# EAGLE design Schematic_tema (EAGLE 9.7.0)

## Sheet 1 of 2
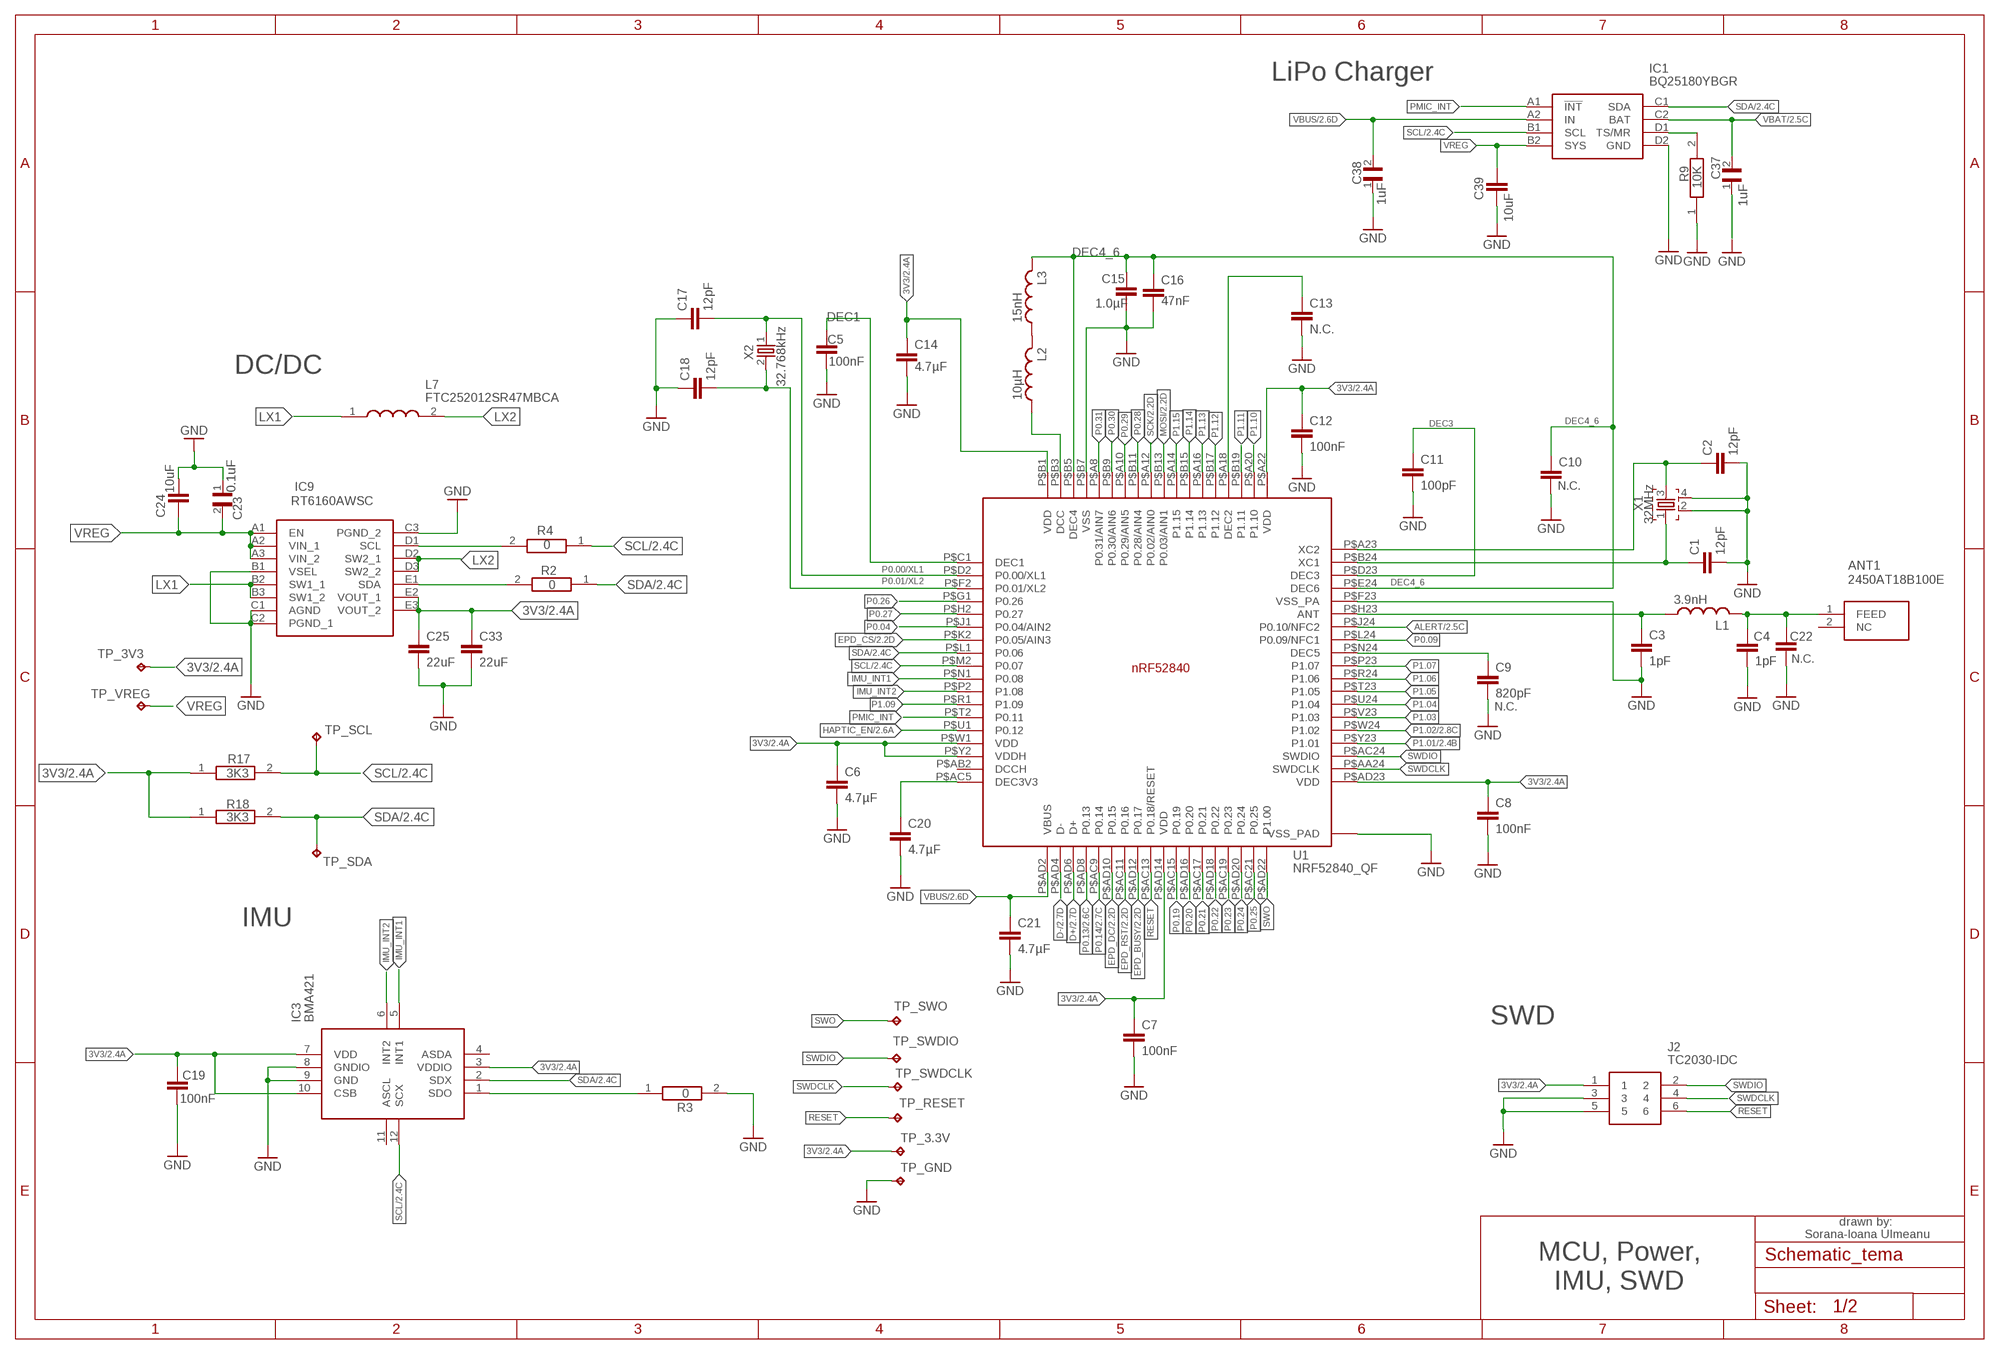
[diagram p0: schematic, sheet 1]

### Parts
ANT1  2450AT18B100E  2450AT18B100E_2450AT18B100E  [2450AT18B100E_ANTC3216X140N]
C1  12pF  PERFECT_0402_CAP_0402  [PERFECT_0402_0402]
C2  12pF  PERFECT_0402_CAP_0402  [PERFECT_0402_0402]
C3  1pF  PERFECT_0402_CAP_0402  [PERFECT_0402_0402]
C4  1pF  PERFECT_0402_CAP_0402  [PERFECT_0402_0402]
C5  100nF  PERFECT_0402_CAP_0402  [PERFECT_0402_0402]
C6  4.7µF  PERFECT_0402_CAP_0402  [PERFECT_0402_0402]
C7  100nF  PERFECT_0402_CAP_0402  [PERFECT_0402_0402]
C8  100nF  PERFECT_0402_CAP_0402  [PERFECT_0402_0402]
C9  820pF  PERFECT_0402_CAP_0402  [PERFECT_0402_0402]
C10  PERFECT_0402_CAP_0402  [PERFECT_0402_0402]
C11  100pF  PERFECT_0402_CAP_0402  [PERFECT_0402_0402]
C12  100nF  PERFECT_0402_CAP_0402  [PERFECT_0402_0402]
C13  N.C.  PERFECT_0402_CAP_0402  [PERFECT_0402_0402]
C14  4.7µF  PERFECT_0402_CAP_0402  [PERFECT_0402_0402]
C15  1.0µF  PERFECT_0402_CAP_0402  [PERFECT_0402_0402]
C16  47nF  PERFECT_0402_CAP_0402  [PERFECT_0402_0402]
C17  12pF  PERFECT_0402_CAP_0402  [PERFECT_0402_0402]
C18  12pF  PERFECT_0402_CAP_0402  [PERFECT_0402_0402]
C19  100nF  PERFECT_0402_CAP_0402  [PERFECT_0402_0402]
C20  4.7µF  PERFECT_0402_CAP_0402  [PERFECT_0402_0402]
C21  4.7µF  PERFECT_0402_CAP_0402  [PERFECT_0402_0402]
C22  PERFECT_0402_CAP_0402  [PERFECT_0402_0402]
C23  0.1uF  GRM011R60J152KE01L_1_GRM011R60J152KE01L  [GRM011R60J152KE01L_1_0201]
C24  10uF  PERFECT_0402_CAP_0402  [PERFECT_0402_0402]
C25  22uF  PERFECT_0402_CAP_0402  [PERFECT_0402_0402]
C33  22uF  PERFECT_0402_CAP_0402  [PERFECT_0402_0402]
C37  1uF  GRM011R60J152KE01L_1_GRM011R60J152KE01L  [GRM011R60J152KE01L_1_0201]
C38  1uF  GRM011R60J152KE01L_1_GRM011R60J152KE01L  [GRM011R60J152KE01L_1_0201]
C39  10uF  PERFECT_0402_CAP_0402  [PERFECT_0402_0402]
IC1  BQ25180YBGR  BQ25180YBGR_BQ25180YBGR  [BQ25180YBGR_BGA8C40P2X4_100X155X50]
IC3  BMA421  BMA423_BMA423  [BMA423_BMA423]
IC9  RT6160AWSC  RT6160AWSC_RT6160AWSC  [RT6160AWSC_BGA15C40P3X5_140X230X60]
J2  TC2030-IDC  TC2030-IDC_TC2030-IDC  [TC2030-IDC_TC2030IDC]
L1  3.9nH  NORDIC_NRF_2_INDUCTOR_0402_L  [NORDIC_NRF_2_RESC0402_L]
L2  10µH  NORDIC_NRF_2_INDUCTOR_0402_L  [NORDIC_NRF_2_RESC0402_L]
L3  15nH  NORDIC_NRF_2_INDUCTOR_0402_L  [NORDIC_NRF_2_RESC0402_L]
L7  FTC252012SR47MBCA  MLP2016SR47MT0S1_FTC252012SR47MBCA  [MLP2016SR47MT0S1_INDC2016X100N]
R2  0  CPF0201D7K68C1_CPF0201D7K68C1  [CPF0201D7K68C1_0201]
R3  0  ERA-1AEB3401C_CPF0201D7K68C1  [ERA-1AEB3401C_0201]
R4  0  CPF0201D7K68C1_CPF0201D7K68C1  [CPF0201D7K68C1_0201]
R9  10K  CPF0201D7K68C1_CPF0201D7K68C1  [CPF0201D7K68C1_0201]
R17  3K3  CPF0201D7K68C1_CPF0201D7K68C1  [CPF0201D7K68C1_0201]
R18  3K3  CPF0201D7K68C1_CPF0201D7K68C1  [CPF0201D7K68C1_0201]
TP_3.3V  HECTOR_WATCH_1_TPTP20R  [HECTOR_WATCH_1_TP20R]
TP_3V3  HECTOR_WATCH_1_TPTP20R  [HECTOR_WATCH_1_TP20R]
TP_GND  HECTOR_WATCH_1_TPTP20R  [HECTOR_WATCH_1_TP20R]
TP_RESET  HECTOR_WATCH_1_TPTP20R  [HECTOR_WATCH_1_TP20R]
TP_SCL  HECTOR_WATCH_1_TPTP20R  [HECTOR_WATCH_1_TP20R]
TP_SDA  HECTOR_WATCH_1_TPTP20R  [HECTOR_WATCH_1_TP20R]
TP_SWDCLK  HECTOR_WATCH_1_TPTP20R  [HECTOR_WATCH_1_TP20R]
TP_SWDIO  HECTOR_WATCH_1_TPTP20R  [HECTOR_WATCH_1_TP20R]
TP_SWO  HECTOR_WATCH_1_TPTP20R  [HECTOR_WATCH_1_TP20R]
TP_VREG  HECTOR_WATCH_1_TPTP20R  [HECTOR_WATCH_1_TP20R]
U1  NRF52840_QF  NORDIC_NRF_4_NRF52840_QF  [NORDIC_NRF_4_AQFN50P700X700X85_HS-74N]
X1  32MHz  NORDIC_NRF_XTAL_32MHZ  [NORDIC_NRF_BT-XTAL_2016_N]
X2  32.768kHz  NORDIC_NRF_1_XTAL_32KHZ  [NORDIC_NRF_1_XTAL_3215_N]

### Nets
3V3/2.4A: C6.1 C7.1 C8.1 C12.1 C14.1 C19.1 C25.1 C33.1 IC3.3(VDDIO) IC3.7(VDD) IC3.10(CSB) IC9.E2(VOUT_1) IC9.E3(VOUT_2) J2.1 R17.1 R18.1 TP_3.3V.TP TP_3V3.TP U1.P$A22(VDD) U1.P$AD14(VDD) U1.P$AD23(VDD) U1.P$B1(VDD) U1.P$W1(VDD) U1.P$Y2(VDDH)
ALERT/2.5C: U1.P$J24(P0.10/NFC2)
D+/2.7D: U1.P$AD6(D+)
D-/2.7D: U1.P$AD4(D-)
EPD_BUSY/2.2D: U1.P$AD12(P0.17)
EPD_CS/2.2D: U1.P$K2(P0.05/AIN3)
EPD_DC/2.2D: U1.P$AD10(P0.15)
EPD_RST/2.2D: U1.P$AC11(P0.16)
GND: C1.2 C2.2 C3.2 C4.2 C5.1 C6.2 C7.2 C8.2 C9.2 C10.2 C11.2 C12.2 C13.2 C14.2 C15.2 C16.2 C17.1 C18.1 C19.2 C20.2 C21.2 C22.2 C23.1 C24.1 C25.2 C33.2 C38.1 C39.2 IC1.D2(GND) IC3.8(GNDIO) IC3.9(GND) IC9.B1(VSEL) IC9.C1(AGND) IC9.C2(PGND_1) IC9.C3(PGND_2) J2.3 J2.5 R3.2 R9.1 TP_GND.TP U1.P$74(VSS_PAD) U1.P$75(VSS_PAD) U1.P$76(VSS_PAD) U1.P$77(VSS_PAD) U1.P$78(VSS_PAD) U1.P$79(VSS_PAD) U1.P$80(VSS_PAD) U1.P$81(VSS_PAD) U1.P$82(VSS_PAD) U1.P$83(VSS_PAD) U1.P$84(VSS_PAD) U1.P$85(VSS_PAD) U1.P$86(VSS_PAD) U1.P$87(VSS_PAD) U1.P$88(VSS_PAD) U1.P$89(VSS_PAD) U1.P$90(VSS_PAD) U1.P$B7(VSS) U1.P$F23(VSS_PA) X1.2 X1.4 ; also sheet 2
HAPTIC_EN/2.6A: U1.P$U1(P0.12)
IMU_INT1: IC3.5(INT1) U1.P$N1(P0.08)
IMU_INT2: IC3.6(INT2) U1.P$P2(P1.08)
LX1: IC9.B2(SW1_1) IC9.B3(SW1_2) L7.1
LX2: IC9.D2(SW2_1) IC9.D3(SW2_2) L7.2
MOSI/2.2D: U1.P$B13(P0.03/AIN1)
N$1: IC3.1(SDO) R3.1
N$2: C5.2 U1.P$C1(DEC1)
N$3: L2.2 U1.P$B3(DCC)
N$4: C37.1
N$5: IC9.D1(SCL) R4.2
N$6: C10.1 C15.1 C16.1 L3.1 U1.P$B5(DEC4) U1.P$E24(DEC6)
N$7: IC1.D1(TS/MR) R9.2
N$8: IC9.E1(SDA) R2.2
N$9: C13.1 U1.P$A18(DEC2)
N$10: L2.1 L3.2
N$12: C17.2 U1.P$D2(P0.00/XL1) X2.1
N$13: C18.2 U1.P$F2(P0.01/XL2) X2.2
N$14: C20.1 U1.P$AC5(DEC3V3)
N$15: C11.1 U1.P$D23(DEC3)
N$16: C2.1 U1.P$A23(XC2) X1.3
N$17: C1.1 U1.P$B24(XC1) X1.1
N$18: C3.1 L1.1 U1.P$H23(ANT)
N$19: ANT1.1(FEED) C4.1 C22.1 L1.2
N$22: C9.1 U1.P$N24(DEC5)
P0.04: U1.P$J1(P0.04/AIN2)
P0.09: U1.P$L24(P0.09/NFC1)
P0.13/2.6C: U1.P$AD8(P0.13)
P0.14/2.7C: U1.P$AC9(P0.14)
P0.19: U1.P$AC15(P0.19)
P0.20: U1.P$AD16(P0.20)
P0.21: U1.P$AC17(P0.21)
P0.22: U1.P$AD18(P0.22)
P0.23: U1.P$AC19(P0.23)
P0.24: U1.P$AD20(P0.24)
P0.25: U1.P$AC21(P0.25)
P0.26: U1.P$G1(P0.26)
P0.27: U1.P$H2(P0.27)
P0.28: U1.P$B11(P0.28/AIN4)
P0.29: U1.P$A10(P0.29/AIN5)
P0.30: U1.P$B9(P0.30/AIN6)
P0.31: U1.P$A8(P0.31/AIN7)
P1.01/2.4B: U1.P$Y23(P1.01)
P1.02/2.8C: U1.P$W24(P1.02)
P1.03: U1.P$V23(P1.03)
P1.04: U1.P$U24(P1.04)
P1.05: U1.P$T23(P1.05)
P1.06: U1.P$R24(P1.06)
P1.07: U1.P$P23(P1.07)
P1.09: U1.P$R1(P1.09)
P1.10: U1.P$A20(P1.10)
P1.11: U1.P$B19(P1.11)
P1.12: U1.P$B17(P1.12)
P1.13: U1.P$A16(P1.13)
P1.14: U1.P$B15(P1.14)
P1.15: U1.P$A14(P1.15)
PMIC_INT: IC1.A1(!INT) U1.P$T2(P0.11)
RESET: J2.6 TP_RESET.TP U1.P$AC13(P0.18/RESET)
SCK/2.2D: U1.P$A12(P0.02/AIN0)
SCL/2.4C: IC1.B1(SCL) IC3.12(SCX) R4.1 R17.2 TP_SCL.TP U1.P$M2(P0.07)
SDA/2.4C: IC1.C1(SDA) IC3.2(SDX) R2.1 R18.2 TP_SDA.TP U1.P$L1(P0.06)
SWDCLK: J2.4 TP_SWDCLK.TP U1.P$AA24(SWDCLK)
SWDIO: J2.2 TP_SWDIO.TP U1.P$AC24(SWDIO)
SWO: TP_SWO.TP U1.P$AD22(P1.00)
VBAT/2.5C: C37.2 IC1.C2(BAT)
VBUS/2.6D: C21.1 C38.2 IC1.A2(IN) U1.P$AD2(VBUS)
VREG: C23.2 C24.2 C39.1 IC1.B2(SYS) IC9.A1(EN) IC9.A2(VIN_1) IC9.A3(VIN_2) TP_VREG.TP
Unconnected: ANT1.2(NC) IC3.4(ASDA) IC3.11(ASCL) U1.P$AB2(DCCH)

### Notes on the sheet
- LiPo Charger
- DEC4_6
- DEC1
- DC/DC
- DEC4_6
- DEC3
- N.C.
- P0.00/XL1
- P0.01/XL2 | DEC4_6
- N.C.
- N.C.
- IMU
- SWD
- drawn by: 
  Sorana-Ioana Ulmeanu
- MCU, Power,
  IMU, SWD

## Sheet 2 of 2
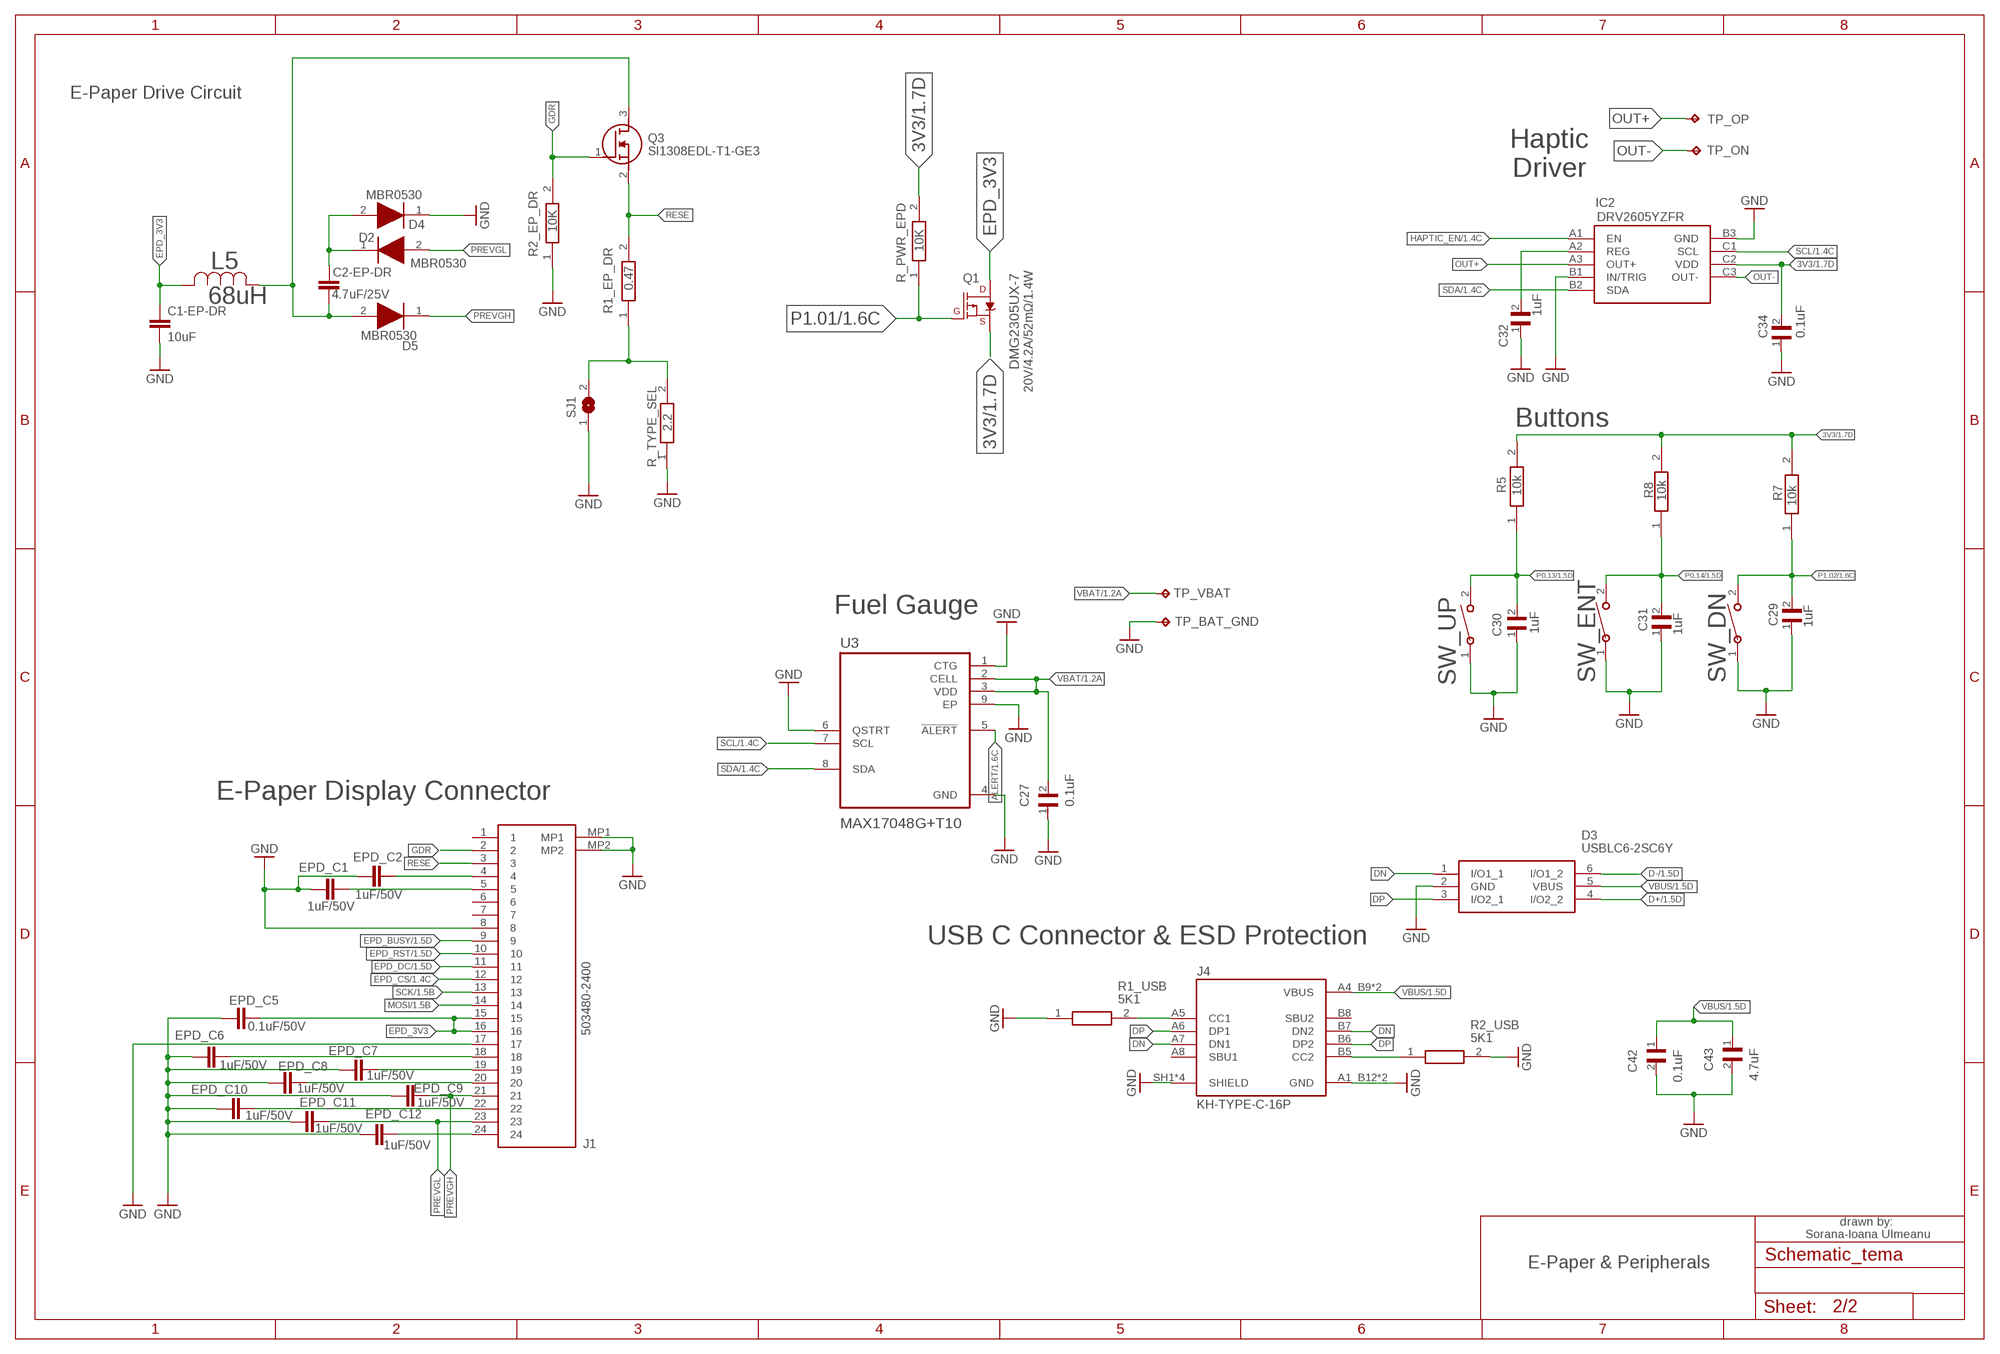
[diagram p1: schematic, sheet 2]

### Parts
C1-EP-DR  10uF  PERFECT_0402_CAP_0402  [PERFECT_0402_0402]
C2-EP-DR  4.7uF/25V  PERFECT_0402_CAP_0402  [PERFECT_0402_0402]
C27  0.1uF  GRM011R60J152KE01L_1_GRM011R60J152KE01L  [GRM011R60J152KE01L_1_0201]
C29  1uF  GRM011R60J152KE01L_1_GRM011R60J152KE01L  [GRM011R60J152KE01L_1_0201]
C30  1uF  GRM011R60J152KE01L_1_GRM011R60J152KE01L  [GRM011R60J152KE01L_1_0201]
C31  1uF  GRM011R60J152KE01L_1_GRM011R60J152KE01L  [GRM011R60J152KE01L_1_0201]
C32  1uF  GRM011R60J152KE01L_2_GRM011R60J152KE01L  [GRM011R60J152KE01L_2_CAPC0201X13N]
C34  0.1uF  GRM011R60J152KE01L_2_GRM011R60J152KE01L  [GRM011R60J152KE01L_2_CAPC0201X13N]
C42  0.1uF  GRM011R60J152KE01L_1_GRM011R60J152KE01L  [GRM011R60J152KE01L_1_0201]
C43  4.7uF  GRM011R60J152KE01L_1_GRM011R60J152KE01L  [GRM011R60J152KE01L_1_0201]
D2  MBR0530  ESP32_C6_LIBRARY_5_MBR0530  [ESP32_C6_LIBRARY_5_SOD3716X135N]
D3  USBLC6-2SC6Y  ESP32_C6_LIBRARY_3_USBLC6-2SC6Y  [ESP32_C6_LIBRARY_3_SOT95P280X145-6N]
D4  MBR0530  ESP32_C6_LIBRARY_5_MBR0530  [ESP32_C6_LIBRARY_5_SOD3716X135N]
D5  MBR0530  ESP32_C6_LIBRARY_5_MBR0530  [ESP32_C6_LIBRARY_5_SOD3716X135N]
EPD_C1  1uF/50V  PERFECT_0402_CAP_0402  [PERFECT_0402_0402]
EPD_C2  1uF/50V  PERFECT_0402_CAP_0402  [PERFECT_0402_0402]
EPD_C5  0.1uF/50V  PERFECT_0402_CAP_0402  [PERFECT_0402_0402]
EPD_C6  1uF/50V  PERFECT_0402_CAP_0402  [PERFECT_0402_0402]
EPD_C7  1uF/50V  PERFECT_0402_CAP_0402  [PERFECT_0402_0402]
EPD_C8  1uF/50V  PERFECT_0402_CAP_0402  [PERFECT_0402_0402]
EPD_C9  1uF/50V  PERFECT_0402_CAP_0402  [PERFECT_0402_0402]
EPD_C10  1uF/50V  PERFECT_0402_CAP_0402  [PERFECT_0402_0402]
EPD_C11  1uF/50V  PERFECT_0402_CAP_0402  [PERFECT_0402_0402]
EPD_C12  1uF/50V  PERFECT_0402_CAP_0402  [PERFECT_0402_0402]
IC2  DRV2605YZFR  DRV2605YZFR_DRV2605YZFR  [DRV2605YZFR_BGA9C50P3X3_144X144X62]
J1  503480-2400  503480-2400_503480-2400  [503480-2400_5034802400]
J4  KH-TYPE-C-16P  KH-TYPE-C-16P_KH-TYPE-C-16P  [KH-TYPE-C-16P_KINGHELM_KH-TYPE-C-16P]
L5  68uH  ESP32_C6_LIBRARY_2_744043680IND_4828-WE-TPC_WRE  [ESP32_C6_LIBRARY_2_IND_4828-WE-TPC_WRE]
Q1  20V/4.2A/52mΩ/1.4W  ESP32_C6_LIBRARY_4_ESP32_WROVER_SPARKFUN-DISCRETESEMI_MOSFET_PCH-DMG2305UX-7  [ESP32_C6_LIBRARY_4_ESP32_C6_LIBRARY_4_ESP32_C6_LIBRARY_4_ESP32_C6_LIBRARY_4_ESP32_WROVER_SPARKFUN-DISCRETESEMI_SOT23-3]
Q3  SI1308EDL-T1-GE3  ESP32_C6_LIBRARY_6_SI1308EDL-T1-GE3  [ESP32_C6_LIBRARY_6_SOT65P210X110-3N]
R1_EP_DR  0.47  CPF0201D7K68C1_CPF0201D7K68C1  [CPF0201D7K68C1_0201]
R1_USB  5K1  CPF0201D7K68C1_CPF0201D7K68C1  [CPF0201D7K68C1_0201]
R2_EP_DR  10K  ERA-1AEB3401C_CPF0201D7K68C1  [ERA-1AEB3401C_0201]
R2_USB  5K1  CPF0201D7K68C1_CPF0201D7K68C1  [CPF0201D7K68C1_0201]
R5  10k  CPF0201D7K68C1_CPF0201D7K68C1  [CPF0201D7K68C1_0201]
R7  10k  CPF0201D7K68C1_CPF0201D7K68C1  [CPF0201D7K68C1_0201]
R8  10k  CPF0201D7K68C1_CPF0201D7K68C1  [CPF0201D7K68C1_0201]
R_PWR_EPD  10K  CPF0201D7K68C1_CPF0201D7K68C1  [CPF0201D7K68C1_0201]
R_TYPE_SEL  2.2  ERA-1AEB3401C_CPF0201D7K68C1  [ERA-1AEB3401C_0201]
SJ1  ESP32_C6_LIBRARY_7_JUMPER_SJ  [ESP32_C6_LIBRARY_7_JUMPER_SJ]
SW_DN  2025-10-22_07-23-44_LIBRARY_EVP-AKE31ASW_EVP-AKE31A_PAN  [2025-10-22_07-23-44_LIBRARY_SW_EVP-AKE31A_PAN]
SW_ENT  2025-10-22_07-23-44_LIBRARY_EVP-AKE31ASW_EVP-AKE31A_PAN  [2025-10-22_07-23-44_LIBRARY_SW_EVP-AKE31A_PAN]
SW_UP  2025-10-22_07-23-44_LIBRARY_EVP-AKE31ASW_EVP-AKE31A_PAN  [2025-10-22_07-23-44_LIBRARY_SW_EVP-AKE31A_PAN]
TP_BAT_GND  HECTOR_WATCH_1_TPTP20R  [HECTOR_WATCH_1_TP20R]
TP_ON  HECTOR_WATCH_1_TPTP20R  [HECTOR_WATCH_1_TP20R]
TP_OP  HECTOR_WATCH_1_TPTP20R  [HECTOR_WATCH_1_TP20R]
TP_VBAT  HECTOR_WATCH_1_TPTP20R  [HECTOR_WATCH_1_TP20R]
U3  MAX17048G+T10  ESP32_C6_LIBRARY_MAX17048G+T10  [ESP32_C6_LIBRARY_SON50P200X200X80-9N]

### Nets
3V3/1.7D: C34.2 IC2.C2(VDD) Q1.2(S) R5.2 R7.2 R8.2 R_PWR_EPD.2
ALERT/1.6C: U3.5(!ALERT)
D+/1.5D: D3.4(I/O2_2)
D-/1.5D: D3.6(I/O1_2)
DN: D3.1(I/O1_1) J4.A7(DN1) J4.B7(DN2)
DP: D3.3(I/O2_1) J4.A6(DP1) J4.B6(DP2)
EPD_3V3: C1-EP-DR.1 EPD_C5.2 J1.15 J1.16 L5.2 Q1.3(D)
EPD_BUSY/1.5D: J1.9
EPD_CS/1.4C: J1.12
EPD_DC/1.5D: J1.11
EPD_RST/1.5D: J1.10
GDR: J1.2 Q3.1(G) R2_EP_DR.2
GND: C1-EP-DR.2 C27.1 C29.1 C30.1 C31.1 C32.1 C34.1 C42.2 C43.2 D3.2(GND) D4.1(K) EPD_C1.1 EPD_C2.1 EPD_C5.1 EPD_C6.1 EPD_C7.1 EPD_C8.1 EPD_C9.1 EPD_C10.1 EPD_C11.1 EPD_C12.1 IC2.B1(IN/TRIG) IC2.B3(GND) J1.8 J1.17 J1.MP1 J1.MP2 J4.A1_B12(GND) J4.A12_B1(GND) J4.SH1(SHIELD) J4.SH2(SHIELD) J4.SH3(SHIELD) J4.SH4(SHIELD) R1_USB.1 R2_EP_DR.1 R2_USB.2 R_TYPE_SEL.1 SJ1.1 SW_DN.1 SW_ENT.1 SW_UP.1 TP_BAT_GND.TP U3.1(CTG) U3.4(GND) U3.6(QSTRT) U3.9(EP) ; also sheet 1
HAPTIC_EN/1.4C: IC2.A1(EN)
MOSI/1.5B: J1.14
N$11: C2-EP-DR.2 D5.2(A) L5.1 Q3.3(D)
N$21: R1_EP_DR.1 R_TYPE_SEL.2 SJ1.2
N$23: C2-EP-DR.1 D2.1(K) D4.2(A)
N$24: EPD_C2.2 J1.4
N$25: C32.2 IC2.A2(REG)
N$26: EPD_C1.2 J1.5
N$27: J4.A5(CC1) R1_USB.2
N$29: EPD_C6.2 J1.18
N$30: EPD_C7.2 J1.19
N$31: EPD_C8.2 J1.20
N$32: J4.B5(CC2) R2_USB.1
N$33: EPD_C10.2 J1.22
N$35: EPD_C12.2 J1.24
OUT+: IC2.A3(OUT+) TP_OP.TP
OUT-: IC2.C3(OUT-) TP_ON.TP
P0.13/1.5D: C30.2 R5.1 SW_UP.2
P0.14/1.5D: C31.2 R8.1 SW_ENT.2
P1.01/1.6C: Q1.1(G) R_PWR_EPD.1
P1.02/1.6C: C29.2 R7.1 SW_DN.2
PREVGH: D5.1(K) EPD_C9.2 J1.21
PREVGL: D2.2(A) EPD_C11.2 J1.23
RESE: J1.3 Q3.2(S) R1_EP_DR.2
SCK/1.5B: J1.13
SCL/1.4C: IC2.C1(SCL) U3.7(SCL)
SDA/1.4C: IC2.B2(SDA) U3.8(SDA)
VBAT/1.2A: C27.2 TP_VBAT.TP U3.2(CELL) U3.3(VDD)
VBUS/1.5D: C42.1 C43.1 D3.5(VBUS) J4.A4_B9(VBUS) J4.A9_B4(VBUS)
Unconnected: J1.1 J1.6 J1.7 J4.A8(SBU1) J4.B8(SBU2)

### Notes on the sheet
- E-Paper Drive Circuit
- Haptic
  Driver
- DMG2305UX-7
- Buttons
- Fuel Gauge
- E-Paper Display Connector
- USB C Connector & ESD Protection
- drawn by: 
  Sorana-Ioana Ulmeanu
- E-Paper & Peripherals

## Library data of the parts
ANT1 = InkTime_v5:2450AT18B100E_2450AT18B100E: Antennas 2.45GHz ANTENNA Source: Datasheet <https://www.johansontechnology.com/datasheets/2450AT18B100/2450AT18B100.pdf>; ARROW_PART_NUMBER: 2450AT18B100E; ARROW_PRICE-STOCK: https://www.arrow.com/en/products/2450at18b100e/johanson-dielectrics?utm_currency=USD&region=nac; DESCRIPTION: Antennas 2.45GHz ANTENNA; HEIGHT: 1.4mm; MANUFACTURER_NAME: JOHANSON TECHNOLOGY; MANUFACTURER_PART_NUMBER: 2450AT18B100E; MOUSER_PART_NUMBER: 609-2450AT18B100E; MOUSER_PRICE-STOCK: https://www.mouser.co.uk/ProductDetail/Johanson-Technology/2450AT18B100E?qs=yCnrNFeXz%252Bh5MFsFIXGZGA%3D%3D
C1 C1-EP-DR C2 C2-EP-DR C3-C22 C24 C25 C33 C39 EPD_C1 EPD_C2 EPD_C5-EPD_C12 = InkTime_v5:PERFECT_0402_CAP_0402: 0402 (1005 Metric) Nick Garner - TeleSense
C23 C27 C29-C31 C37 C38 C42 C43 = InkTime_v5:GRM011R60J152KE01L_1_GRM011R60J152KE01L: Check availability <https://pricing.snapeda.com/parts/GRM011R60J152KE01L/Murata/view-part?ref=eda>
C32 C34 = InkTime_v5:GRM011R60J152KE01L_2_GRM011R60J152KE01L: Check availability <https://pricing.snapeda.com/parts/GRM011R60J152KE01L/Murata/view-part?ref=eda>; AVAILABILITY: In Stock; CHECK_PRICES: https://www.snapeda.com/parts/GRM011R60J152KE01L/Murata/view-part/?ref=eda; DESCRIPTION: SMD Capacitor X5R(EIA) with Capacitance: 1500pF Tol. 10%. Rated Voltage: 6.3Vdc; MF: Murata; MP: GRM011R60J152KE01L; PACKAGE: 0201 Murata; PRICE: None; SNAPEDA_LINK: https://www.snapeda.com/parts/GRM011R60J152KE01L/Murata/view-part/?ref=snap
D2 D4 D5 = InkTime_v5:ESP32_C6_LIBRARY_5_MBR0530: ON SEMICONDUCTOR - MBR0530 - DIODE, SCHOTTKY, 0.5A, 30V, SOD-123 Source: Datasheet <http://www.onsemi.com/pub/Collateral/MBR0530T1-D.PDF> Check availability <https://pricing.snapeda.com/parts/MBR0530/ON%20Semiconductor/view-part?ref=eda>; AVAILABILITY: In Stock; CHECK_PRICES: https://www.snapeda.com/parts/MBR0530/Onsemi/view-part/?ref=eda; DESCRIPTION: Diode Schottky 30 V 500mA Surface Mount SOD-123; MF: ON Semiconductor; MP: MBR0530; PACKAGE: SOD-123-2 ON Semiconductor; PRICE: None; PURCHASE-URL: https://www.snapeda.com/api/url_track_click_mouser/?unipart_id=179458&manufacturer=ON Semiconductor&part_name=MBR0530&search_term=None; SNAPEDA_LINK: https://www.snapeda.com/parts/MBR0530/Onsemi/view-part/?ref=snap
D3 = InkTime_v5:ESP32_C6_LIBRARY_3_USBLC6-2SC6Y: Low Cap. ESD Protection Auto SOT-23-6 STMicroelectronics USBLC6-2SC6Y, Dual Uni-Directional TVS Diode Array, 6-Pin SOT-23 Source: Datasheet <https://componentsearchengine.com/Datasheets/1/USBLC6-2SC6Y.pdf> Check availability <https://pricing.snapeda.com/parts/USBLC6-2SC6Y/STMicroelectronics/view-part?ref=eda>; AVAILABILITY: In Stock; CHECK_PRICES: https://www.snapeda.com/parts/USBLC6-2SC6Y/STMicroelectronics/view-part/?ref=eda; DESCRIPTION: 17V Clamp 5A (8/20µs) Ipp Tvs Diode Surface Mount SOT-23-6; MF: STMicroelectronics; MP: USBLC6-2SC6Y; PACKAGE: SOT-23-6 STMicroelectronics; PRICE: None; SNAPEDA_LINK: https://www.snapeda.com/parts/USBLC6-2SC6Y/STMicroelectronics/view-part/?ref=snap
IC1 = InkTime_v5:BQ25180YBGR_BQ25180YBGR: Charger IC Lithium Ion/Polymer, Lithium Iron Phosphate 8-DSBGA (1.6x1.1) Source: Datasheet <https://www.ti.com/lit/ds/symlink/bq25180.pdf?ts=1650264094470&ref_url=https%3A%2F%2Fwww.ti.com%2Fproduct%2FBQ25180>; ARROW_PART_NUMBER: BQ25180YBGR; ARROW_PRICE-STOCK: https://www.arrow.com/en/products/bq25180ybgr/texas-instruments?utm_currency=USD&region=nac; DESCRIPTION: Charger IC Lithium Ion/Polymer, Lithium Iron Phosphate 8-DSBGA (1.6x1.1); HEIGHT: 0.5mm; MANUFACTURER_NAME: Texas Instruments; MANUFACTURER_PART_NUMBER: BQ25180YBGR; MOUSER_PART_NUMBER: 595-BQ25180YBGR; MOUSER_PRICE-STOCK: https://www.mouser.co.uk/ProductDetail/Texas-Instruments/BQ25180YBGR?qs=doiCPypUmgEWjAK%252BJAX6Tw%3D%3D
IC2 = InkTime_v5:DRV2605YZFR_DRV2605YZFR: Haptic Driver for ERM/LRA with Built-In Library and Smart Loop Architecture Source: Datasheet <http://www.ti.com/lit/gpn/drv2605>; ARROW_PART_NUMBER: DRV2605YZFR; ARROW_PRICE-STOCK: https://www.arrow.com/en/products/drv2605yzfr/texas-instruments?region=nac; DESCRIPTION: Haptic Driver for ERM/LRA with Built-In Library and Smart Loop Architecture; HEIGHT: 0.625mm; MANUFACTURER_NAME: Texas Instruments; MANUFACTURER_PART_NUMBER: DRV2605YZFR
IC3 = InkTime_v5:BMA423_BMA423: Accelerometers Triaxial low-g 12bit Acceleration Sensor Source: Datasheet <https://www.mouser.com/datasheet/2/783/BST-BMA423-DS000-1509600.pdf>; ARROW_PART_NUMBER: BMA423; ARROW_PRICE-STOCK: https://www.arrow.com/en/products/bma423/bosch; DESCRIPTION: Accelerometers Triaxial low-g 12bit Acceleration Sensor; HEIGHT: 1mm; MANUFACTURER_NAME: BOSCH; MANUFACTURER_PART_NUMBER: BMA423; MOUSER_PART_NUMBER: 262-BMA423; MOUSER_PRICE-STOCK: https://www.mouser.co.uk/ProductDetail/Bosch-Sensortec/BMA423?qs=HXFqYaX1Q2xC%252BSgeGoX3mg%3D%3D; SPICEPREFIX: X
IC9 = InkTime_v5:RT6160AWSC_RT6160AWSC: Buck-Boost Regulator Positive Output Step-Up/Step-Down I2C DC-DC Controller IC 15-WL-CSP (BSC) (1.4x2.3) Source: Datasheet <https://www.richtek.com/SaveDownload.aspx?specid=RT6160A>; DESCRIPTION: Buck-Boost Regulator Positive Output Step-Up/Step-Down I2C DC-DC Controller IC 15-WL-CSP (BSC) (1.4x2.3); HEIGHT: 0.6mm; MANUFACTURER_NAME: RICHTEK; MANUFACTURER_PART_NUMBER: RT6160AWSC; MOUSER_PART_NUMBER: 835-RT6160AWSC; MOUSER_PRICE-STOCK: https://www.mouser.co.uk/ProductDetail/Richtek/RT6160AWSC?qs=amGC7iS6iy%2FLd9PSoixZXQ%3D%3D
J1 = InkTime_v5:503480-2400_503480-2400: FFC & FPC Connectors 0.5mm FPC RA SMT Dual Contact 24Ckt Source: Datasheet <https://componentsearchengine.com/Datasheets/1/503480-2400.pdf>; DESCRIPTION: FFC & FPC Connectors 0.5mm FPC RA SMT Dual Contact 24Ckt; HEIGHT: 1.87mm; MANUFACTURER_NAME: Molex; MANUFACTURER_PART_NUMBER: 503480-2400; MOUSER_PART_NUMBER: 538-503480-2400; MOUSER_PRICE-STOCK: https://www.mouser.co.uk/ProductDetail/Molex/503480-2400?qs=OAhjpuo3Vu7efIoxFh9AOw%3D%3D
J2 = InkTime_v5:TC2030-IDC_TC2030-IDC: CABLE ADAPTER 6 POS Source: Datasheet <https://datasheet.datasheetarchive.com/originals/distributors/Datasheets_SAMA/62bc384e093448baaaa63dbd0b9d8707.pdf>; DESCRIPTION: CABLE ADAPTER 6 POS; HEIGHT: 19mm; MANUFACTURER_NAME: Tag Connect; MANUFACTURER_PART_NUMBER: TC2030-IDC
J4 = InkTime_v5:KH-TYPE-C-16P_KH-TYPE-C-16P: Check availability <https://pricing.snapeda.com/parts/KH-TYPE-C-16P/kinghelm/view-part?ref=eda>; AVAILABILITY: Not in stock; CHECK_PRICES: https://www.snapeda.com/parts/KH-TYPE-C-16P/Kinghelm/view-part/?ref=eda; MF: kinghelm; MP: KH-TYPE-C-16P; PACKAGE: None; PRICE: None; SNAPEDA_LINK: https://www.snapeda.com/parts/KH-TYPE-C-16P/Kinghelm/view-part/?ref=snap
L1-L3 = InkTime_v5:NORDIC_NRF_2_INDUCTOR: Generic chip inductor
L5 = InkTime_v5:ESP32_C6_LIBRARY_2_744043680; COPYRIGHT: Copyright (C) 2024 Ultra Librarian. All rights reserved.; MANUFACTURER_PART_NUMBER: 744043680; MFR_NAME: Wurth Electronics
L7 = InkTime_v5:MLP2016SR47MT0S1_FTC252012SR47MBCA: SMD / SMT Inductors (Coils), L=0.47?H, L x W x T : Source: Datasheet <https://product.tdk.com/system/files/dam/doc/product/inductor/inductor/smd/catalog/inductor_commercial_power_mlp2016_en.pdf>; DESCRIPTION: SMD / SMT Inductors (Coils), L=0.47?H, L x W x T :; HEIGHT: 1mm; JLCPCB: https://jlcpcb.com/partdetail/6763488-FTC252012SR47MBCA/C5832368; MANUFACTURER_NAME: TDK; MANUFACTURER_PART_NUMBER: FTC252012SR47MBCA
Q1 = InkTime_v5:ESP32_C6_LIBRARY_4_ESP32_WROVER_SPARKFUN-DISCRETESEMI_MOSFET_PCH: P-channel MOSFETs Voltage controlled devices that allow control of high current outputs. SparkFun Products: SparkFun ESP32 Thing <https://www.sparkfun.com/products/13907> SparkFun ESP8266 Thing <https://www.sparkfun.com/products/13231> SparkFun Pi Servo HAT V2 <https://www.sparkfun.com/products/15316> DMG2305UX-7 (20V/4.2A/SOT23-3); PROD_ID: TRAN-14388
Q3 = InkTime_v5:ESP32_C6_LIBRARY_6_SI1308EDL-T1-GE3: MOSFET N-Ch 30V 1.5A TrenchFET SC70 Vishay Si1308EDL-T1-GE3 N-channel MOSFET Transistor, 1.5 A, 30 V, 3-Pin SC-70 Source: Datasheet <https://componentsearchengine.com/Datasheets/1/SI1308EDL-T1-GE3.pdf> Check availability <https://pricing.snapeda.com/parts/SI1308EDL-T1-GE3/Vishay%20Siliconix/view-part?ref=eda>; AVAILABILITY: In Stock; CHECK_PRICES: https://www.snapeda.com/parts/SI1308EDL-T1-GE3/Vishay+Siliconix/view-part/?ref=eda; DESCRIPTION: Si1308EDL-T1-GE3 N-channel MOSFET Transistor, 1.5 A, 30 V, 3-Pin SC-70 | Siliconix / Vishay SI1308EDL-T1-GE3; MF: Vishay Siliconix; MP: SI1308EDL-T1-GE3; PACKAGE: SOT-323 Vishay Semiconductor; PRICE: None; PURCHASE-URL: https://www.snapeda.com/api/url_track_click_mouser/?unipart_id=274603&manufacturer=Vishay Siliconix&part_name=SI1308EDL-T1-GE3&search_term=None; SNAPEDA_LINK: https://www.snapeda.com/parts/SI1308EDL-T1-GE3/Vishay+Siliconix/view-part/?ref=snap
R1_EP_DR R1_USB R2 R2_USB R4 R5 R7-R9 R17 R18 R_PWR_EPD = InkTime_v5:CPF0201D7K68C1_CPF0201D7K68C1: 7.68k 0201 Thin Film Surface Mount Fixed Resistor +/-0.5% 0.031W CPF0201D7K68C1 Source: Datasheet <http://www.te.com/commerce/DocumentDelivery/DDEController?Action=showdoc&DocId=Data Sheet1773200-1ApdfEnglishENG_DS_1773200-1_A.pdf4-2176215-6>
R2_EP_DR R3 R_TYPE_SEL = InkTime_v5:ERA-1AEB3401C_CPF0201D7K68C1: 7.68k 0201 Thin Film Surface Mount Fixed Resistor +/-0.5% 0.031W CPF0201D7K68C1 Source: Datasheet <http://www.te.com/commerce/DocumentDelivery/DDEController?Action=showdoc&DocId=Data Sheet1773200-1ApdfEnglishENG_DS_1773200-1_A.pdf4-2176215-6>
SJ1 = InkTime_v5:ESP32_C6_LIBRARY_7_JUMPER_SJ: SMD solder JUMPER
SW_DN SW_ENT SW_UP = InkTime_v5:2025-10-22_07-23-44_LIBRARY_EVP-AKE31A; COPYRIGHT: Copyright (C) 2025 Ultra Librarian. All rights reserved.; DIGI-KEY_PART_NUMBER_1: P123437TR-ND; DIGI-KEY_PART_NUMBER_2: P123437CT-ND; DIGI-KEY_PART_NUMBER_3: P123437DKR-ND; MANUFACTURER_NAME: Panasonic; MANUFACTURER_PART_NUMBER: EVP-AKE31A
TP_3.3V TP_3V3 TP_BAT_GND TP_GND TP_ON TP_OP TP_RESET TP_SCL TP_SDA TP_SWDCLK TP_SWDIO TP_SWO TP_VBAT TP_VREG = InkTime_v5:HECTOR_WATCH_1_TP: Test pad
U1 = InkTime_v5:NORDIC_NRF_4_NRF52840_QF: nRF52840 Features Advanced Single chip 2.4 GHz multi-protocol SoC 32-bit ARM Cortex-M4F Processor 1.7v to 5.5v operation 1MB flash + 256kB RAM Bluetooth 5 support for long range and high throughput 802.15.4 radio support On-chip NFC PPI –Programmable Peripheral Interconnect Automated power management system with automatic power management of each peripheral Configurable I/O mapping for analog and digital I/O 48 x GPIO 1 x QSPI 4 x Master/Slave SPI 2 x Two-wire interface (I²C) I²S interface 2 x UART 4 x PWM USB 2.0 controller ARM TrustZone CryptoCell-310 Cryptographic and security module AES 128-bit ECB/CCM/AAR hardware accelerator Digital microphone interface (PDM) Quadrature decoder 12-bit ADC Low power comparator On-chip 50Ω balun On-air compatible with nRF52, nRF51 and nRF24 Series Applications Advanced high performance wearables Wearables for secure payments Virtual Reality/Augmented Reality systems Smart Home sensor networks Smart city sensor networks High performance HID controllers Internet of Things (IoT) sensor networks Smart door locks Smart lighting networks Connected white goods
U3 = InkTime_v5:ESP32_C6_LIBRARY_MAX17048G+T10: Check availability <https://pricing.snapeda.com/parts/MAX17048G%2BT10/Analog%20Devices/view-part?ref=eda>; AVAILABILITY: In Stock; CHECK_PRICES: https://www.snapeda.com/parts/MAX17048G+T10/Analog+Devices/view-part/?ref=eda; DESCRIPTION: 3µA 1-Cell/2-Cell Fuel Gauge with ModelGauge; MF: Analog Devices; MP: MAX17048G+T10; PACKAGE: TDFN-8 Maxim; PRICE: None; PURCHASE-URL: https://www.snapeda.com/api/url_track_click_mouser/?unipart_id=329239&manufacturer=Analog Devices&part_name=MAX17048G+T10&search_term=None; SNAPEDA_LINK: https://www.snapeda.com/parts/MAX17048G+T10/Analog+Devices/view-part/?ref=snap
X1 = InkTime_v5:NORDIC_NRF_XTAL_32MHZ
X2 = InkTime_v5:NORDIC_NRF_1_XTAL_32KHZ

## Board
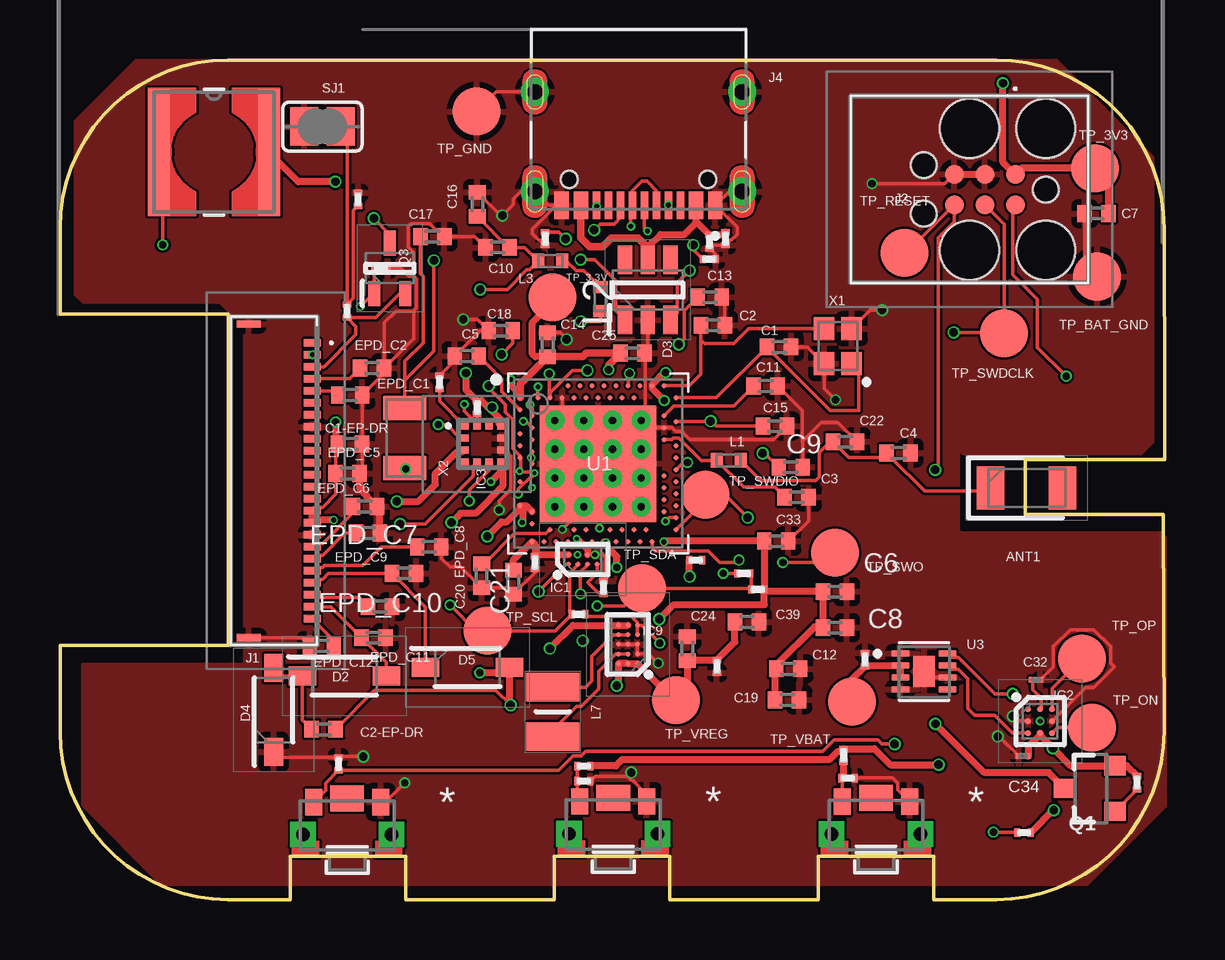
[diagram p2: board, top side]
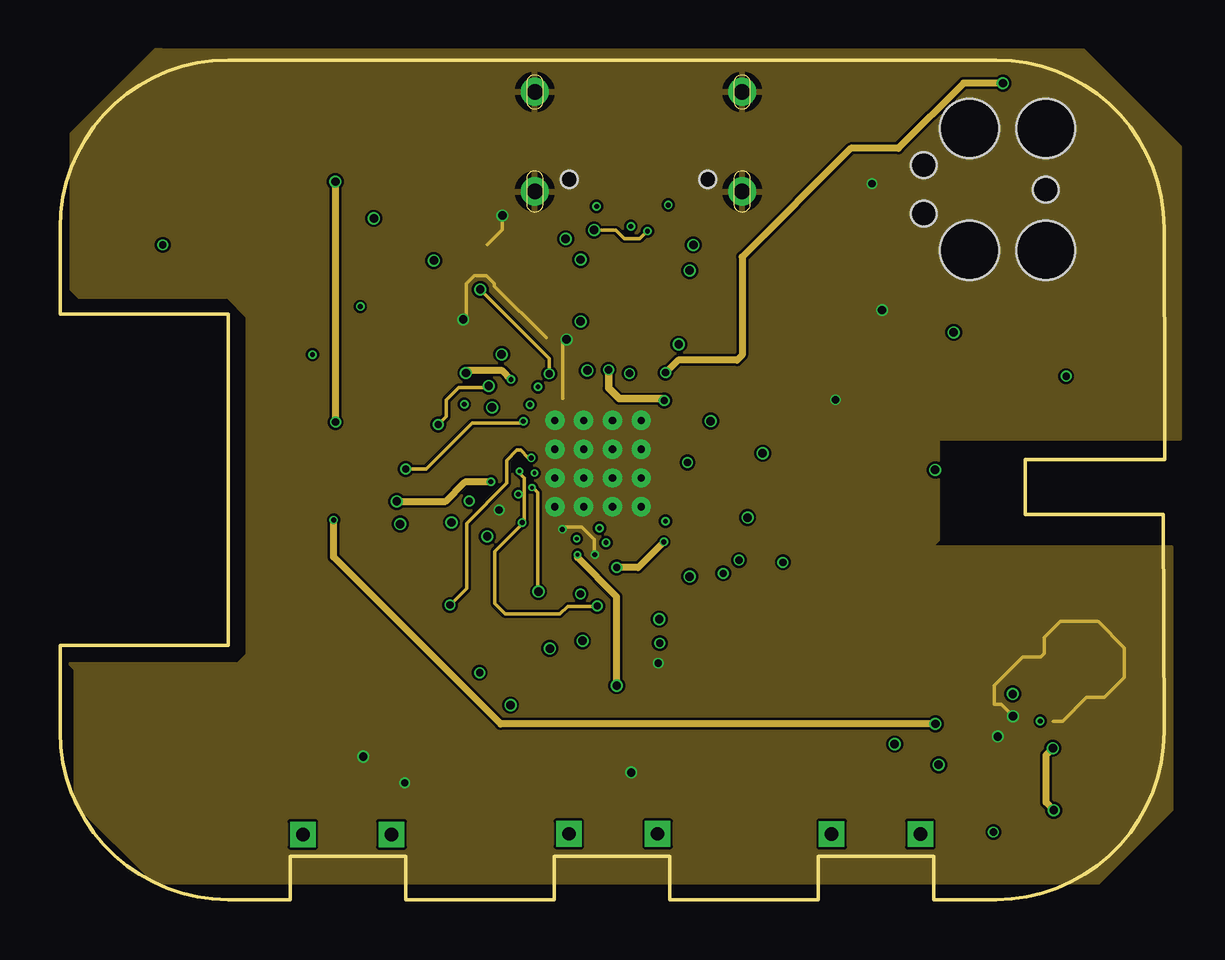
[diagram p3: board, inner layer Route2]
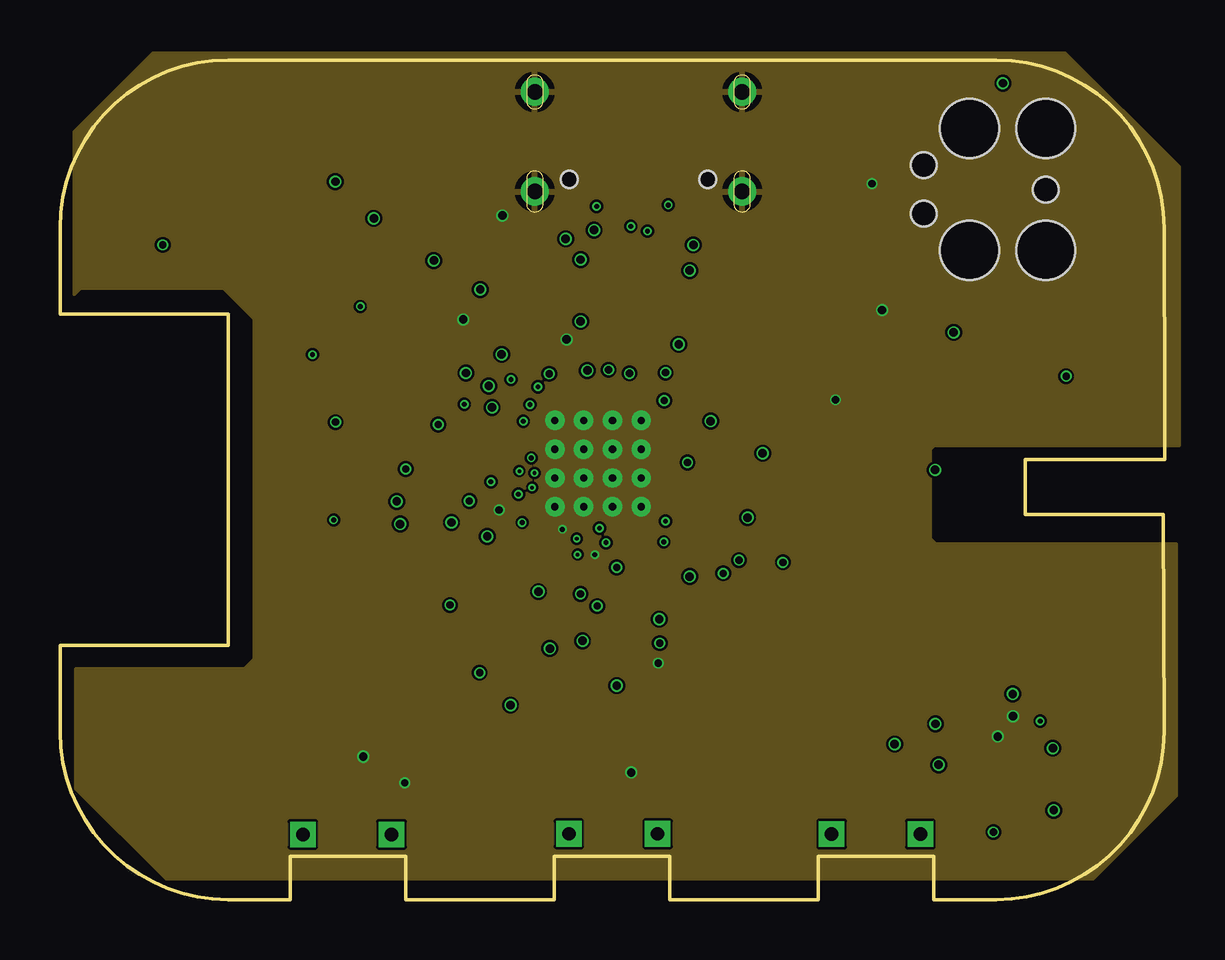
[diagram p4: board, inner layer Route15]
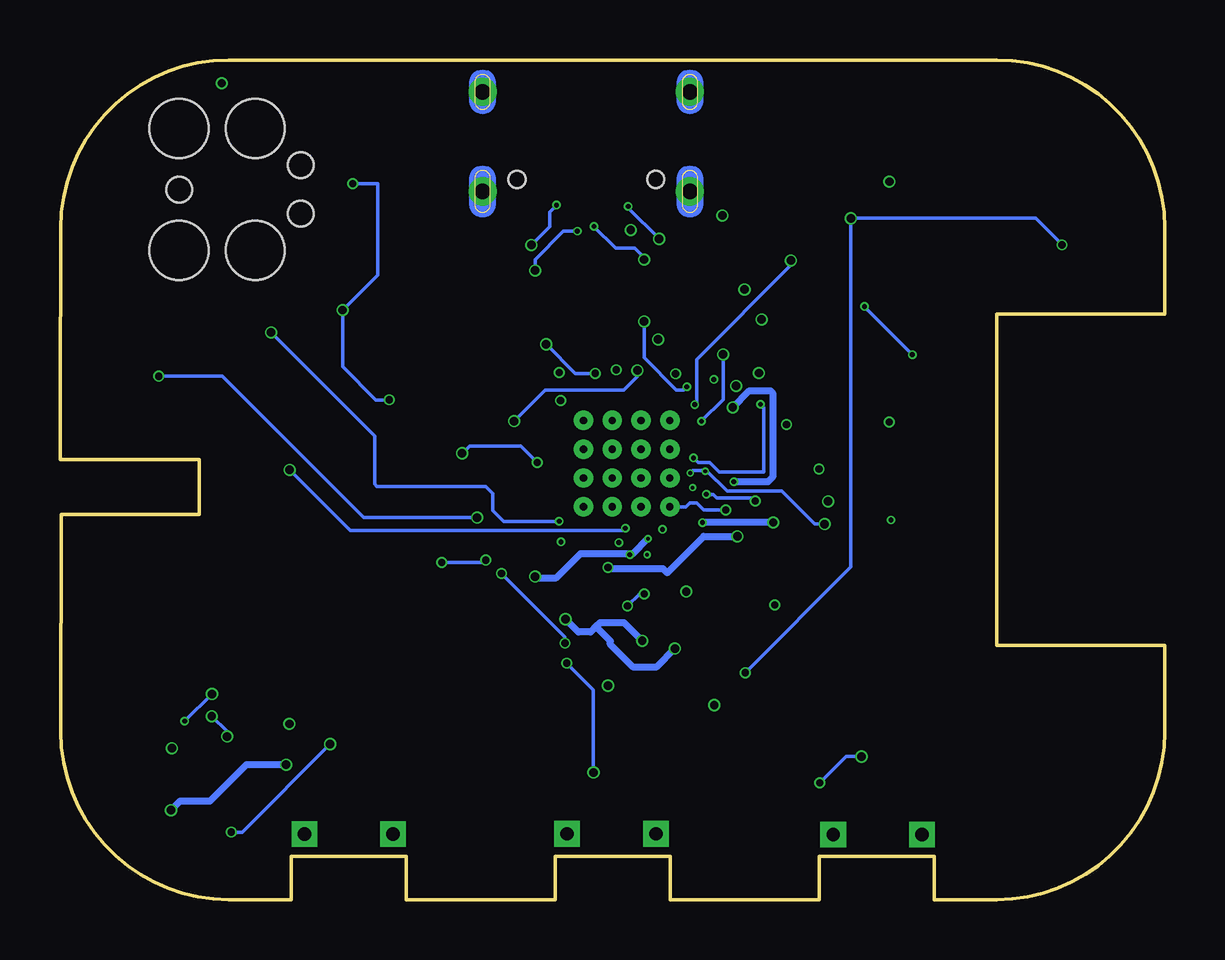
[diagram p5: board, bottom side, seen from below]

Size 46.03 x 35 mm. Coordinates in mm from the lower left corner, seen from the top.
Outline: 0,10.6 0,7 arc90 7,0 9.6,0 9.6,1.8 14.4,1.8 14.4,0 20.6,0 20.6,1.8 25.4,1.8 25.4,0 31.6,0 31.6,1.8 36.4,1.8 36.4,0 39,0 arc90 46,7 45.97,16.04 40.22,16.04 40.22,18.34 46.03,18.34 46.03,20.59 46,28 arc90 39,35 7,35 arc90 0,28 0,24.4 7,24.4 7,10.6 0,10.6
Copper layers (1+2*15+16): Top 0.035mm / dielectric 1.6mm / Route2 0.035mm / dielectric 0.15mm / Route15 0.035mm / dielectric 0.2mm / Bottom 0.035mm
Design rules "jlcpcb-2layers.dru *": minimum track width 5mil, minimum drill 0.2mm, track to track 0.1mm, track to pad 5mil, pad to pad 5mil, via to via 0.05mm, smd to smd 5mil, copper to edge 0mil, drill to drill 6mil, minimum pad ring 10mil, minimum via ring 3mil, stop-mask expansion 4mil, vias tented up to drill 0mil, thermal gap 10mil

### Footprints (pad centres in the part's own frame; a part is rotated, then mirrored left to right if it is on the bottom)
2450AT18B100E_ANTC3216X140N = smd 1.15 x 1.8: 1 -1.5,0; 2 1.5,0
PERFECT_0402_0402 = smd 0.6 x 0.7: 1 -0.5,0; 2 0.5,0
GRM011R60J152KE01L_1_0201 = smd 0.35 x 0.25: 1 0,0.275; 2 0,-0.275
GRM011R60J152KE01L_2_CAPC0201X13N = smd 0.22 x 0.23: 1 -0.185,0; 2 0.185,0
ESP32_C6_LIBRARY_5_SOD3716X135N = smd 1.15 x 0.8: 1 -1.75,0; 2 1.75,0
ESP32_C6_LIBRARY_3_SOT95P280X145-6N = smd 1.2 x 0.6: 1 -1.25,0.95; 2 -1.25,0; 3 -1.25,-0.95; 4 1.25,-0.95; 5 1.25,0; 6 1.25,0.95
BQ25180YBGR_BGA8C40P2X4_100X155X50 = smd 0.2 x 0.2: A1 -0.2,0.6; A2 0.2,0.6; B1 -0.2,0.2; B2 0.2,0.2; C1 -0.2,-0.2; C2 0.2,-0.2; D1 -0.2,-0.6; D2 0.2,-0.6
DRV2605YZFR_BGA9C50P3X3_144X144X62 = smd 0.25 x 0.25: A1 -0.5,0.5; A2 0,0.5; A3 0.5,0.5; B1 -0.5,0; B2 0,0; B3 0.5,0; C1 -0.5,-0.5; C2 0,-0.5; C3 0.5,-0.5
BMA423_BMA423 = smd 0.3 x 0.35: 1 -0.75,-0.775; 2 -0.25,-0.775; 3 0.25,-0.775; 4 0.75,-0.775; 7 0.75,0.775; 8 0.25,0.775; 9 -0.25,0.775; 10 -0.75,0.775 | smd 0.35 x 0.3: 5 0.775,-0.25; 6 0.775,0.25; 11 -0.775,0.25; 12 -0.775,-0.25
RT6160AWSC_BGA15C40P3X5_140X230X60 = smd 0.216 x 0.216: A1 -0.4,0.8; A2 0,0.8; A3 0.4,0.8; B1 -0.4,0.4; B2 0,0.4; B3 0.4,0.4; C1 -0.4,0; C2 0,0; C3 0.4,0; D1 -0.4,-0.4; D2 0,-0.4; D3 0.4,-0.4; E1 -0.4,-0.8; E2 0,-0.8; E3 0.4,-0.8
503480-2400_5034802400 = smd 0.3 x 0.7: 1 -5.75,1.525; 2 -5.25,1.525; 3 -4.75,1.525; 4 -4.25,1.525; 5 -3.75,1.525; 6 -3.25,1.525; 7 -2.75,1.525; 8 -2.25,1.525; 9 -1.75,1.525; 10 -1.25,1.525; 11 -0.75,1.525; 12 -0.25,1.525; 13 0.25,1.525; 14 0.75,1.525; 15 1.25,1.525; 16 1.75,1.525; 17 2.25,1.525; 18 2.75,1.525; 19 3.25,1.525; 20 3.75,1.525; 21 4.25,1.525; 22 4.75,1.525; 23 5.25,1.525; 24 5.75,1.525 | smd 0.3 x 1: MP1 -6.54,-1.125; MP2 6.54,-1.125
TC2030-IDC_TC2030IDC = smd 0.783 x 0.783: 1 -0.953,-0.635; 2 -0.953,0.635; 3 0.317,-0.635; 4 0.317,0.635; 5 1.588,-0.635; 6 1.588,0.635 | hole 2.451: -2.223,-2.54; -2.223,2.54; 0.952,-2.54; 0.952,2.54 | hole 1.067: -2.223,0; 2.857,-1.016; 2.857,1.016
KH-TYPE-C-16P_KINGHELM_KH-TYPE-C-16P = smd 0.6 x 1.15: A1_B12 -3.2,4.725; A4_B9 -2.4,4.725; A9_B4 2.4,4.725; A12_B1 3.2,4.725 | smd 0.3 x 1.15: A5 -1.25,4.725; A6 -0.25,4.725; A7 0.25,4.725; A8 1.25,4.725; B5 1.75,4.725; B6 0.75,4.725; B7 -0.75,4.725; B8 -1.75,4.725 | drill 0.65 pad 1.05: SH1 -4.32,0; SH2 4.32,0; SH3 -4.32,4.15; SH4 4.32,4.15 | hole 0.7: -2.89,3.65; 2.89,3.65
NORDIC_NRF_2_RESC0402_L = smd 0.5 x 0.6: 1 -0.5,0; 2 0.5,0
ESP32_C6_LIBRARY_2_IND_4828-WE-TPC_WRE = smd 0.9 x 5.3: 1 -2.286,0; 2 2.286,0
MLP2016SR47MT0S1_INDC2016X100N = smd 1.2 x 2.2: 1 -1.028,0; 2 1.028,0
ESP32_C6_LIBRARY_4_ESP32_C6_LIBRARY_4_ESP32_C6_LIBRARY_4_ESP32_C6_LIBRARY_4_ESP32_WROVER_SPARKFUN-DISCRETESEMI_SOT23-3 = smd 0.8 x 0.9: 1 -0.95,-1; 2 0.95,-1; 3 0,1.1
ESP32_C6_LIBRARY_6_SOT65P210X110-3N = smd 1.05 x 0.5: 1 -1.05,0.65; 2 -1.05,-0.65; 3 1.05,0
CPF0201D7K68C1_0201 = smd 0.35 x 0.25: 1 0,0.275; 2 0,-0.275
ERA-1AEB3401C_0201 = smd 0.35 x 0.25: 1 0,0.275; 2 0,-0.275
ESP32_C6_LIBRARY_7_JUMPER_SJ = smd 1.168 x 1.6: 1 -0.762,0; 2 0.762,0
2025-10-22_07-23-44_LIBRARY_SW_EVP-AKE31A_PAN = smd 0.711 x 1.092: 1 -1.4,-0.972; 2 1.4,-0.972 | drill 0.559 pad 0.914 square: 3 -1.848,0.381; 4 1.848,0.381 | smd 1.397 x 1.092: 5 0,-1.124
HECTOR_WATCH_1_TP20R = smd 2 x 2: TP 0,0
NORDIC_NRF_4_AQFN50P700X700X85_HS-74N = smd 4.85 x 4.85: P$74 0,0 | drill 0.3 pad 0.6: P$75 -1.8,1.8; P$76 -0.6,1.8; P$77 0.6,1.8; P$78 1.8,1.8; P$79 -1.8,0.6; P$80 -0.6,0.6; P$81 0.6,0.6; P$82 1.8,0.6; P$83 -1.8,-0.6; P$84 -0.6,-0.6; P$85 0.6,-0.6; P$86 1.8,-0.6; P$87 -1.8,-1.8; P$88 -0.6,-1.8; P$89 0.6,-1.8; P$90 1.8,-1.8 | smd 0.2 x 0.2: P$A8 -1.25,3.25; P$A10 -0.75,3.25; P$A12 -0.25,3.25; P$A14 0.25,3.25; P$A16 0.75,3.25; P$A18 1.25,3.25; P$A20 1.75,3.25; P$A22 2.25,3.25; P$A23 2.75,3.25; P$AA24 3.25,-2.25; P$AB2 -2.75,-2.5; P$AC5 -2,-2.75; P$AC9 -1,-2.75; P$AC11 -0.5,-2.75; P$AC13 0,-2.75; P$AC15 0.5,-2.75; P$AC17 1,-2.75; P$AC19 1.5,-2.75; P$AC21 2,-2.75; P$AC24 3.25,-2.75; P$AD2 -2.75,-3.25; P$AD4 -2.25,-3.25; P$AD6 -1.75,-3.25; P$AD8 -1.25,-3.25; P$AD10 -0.75,-3.25; P$AD12 -0.25,-3.25; P$AD14 0.25,-3.25; P$AD16 0.75,-3.25; P$AD18 1.25,-3.25; P$AD20 1.75,-3.25; P$AD22 2.25,-3.25; P$AD23 2.75,-3.25; P$B1 -3.25,2.75; P$B3 -2.5,2.75; P$B5 -2,2.75; P$B7 -1.5,2.75; P$B9 -1,2.75; P$B11 -0.5,2.75; P$B13 0,2.75; P$B15 0.5,2.75; P$B17 1,2.75; P$B19 1.5,2.75; P$B24 3.25,2.75; P$C1 -3.25,2.25; P$D2 -2.75,2; P$D23 2.75,2; P$E24 3.25,1.75; P$F2 -2.75,1.5; P$F23 2.75,1.5; P$G1 -3.25,1.25; P$H2 -2.75,1; P$H23 2.75,1; P$J1 -3.25,0.75; P$J24 3.25,0.75; P$K2 -2.75,0.5; P$L1 -3.25,0.25; P$L24 3.25,0.25; P$M2 -2.75,0; P$N1 -3.25,-0.25; P$N24 3.25,-0.25; P$P2 -2.75,-0.5; P$P23 2.75,-0.5; P$R1 -3.25,-0.75; P$R24 3.25,-0.75; P$T2 -2.75,-1; P$T23 2.75,-1; P$U1 -3.25,-1.25; P$U24 3.25,-1.25; P$V23 2.75,-1.5; P$W1 -3.25,-1.75; P$W24 3.25,-1.75; P$Y2 -2.75,-2; P$Y23 2.75,-2
ESP32_C6_LIBRARY_SON50P200X200X80-9N = smd 0.76 x 0.27: 1 -0.985,0.75; 2 -0.985,0.25; 3 -0.985,-0.25; 4 -0.985,-0.75; 5 0.985,-0.75; 6 0.985,-0.25; 7 0.985,0.25; 8 0.985,0.75 | smd 0.9 x 1.3: 9 0,0
NORDIC_NRF_BT-XTAL_2016_N = smd 0.95 x 0.85: 1 -0.725,-0.575; 2 0.725,-0.575; 3 0.725,0.575; 4 -0.725,0.575
NORDIC_NRF_1_XTAL_3215_N = smd 1 x 1.8: 1 -1.25,0; 2 1.25,0

### Placement (x,y rotation side)
ANT1  40.28,17.16 0 top
C1  29.96,23.04 0 top
C1-EP-DR  12.09,18.99 0 top
C2  27.2,23.94 0 top
C2-EP-DR  10.98,7.1 0 top
C3  30.69,16.77 0 top
C4  34.94,18.62 0 top
C5  16.95,22.66 0 top
C6  32.28,12.84 0 top
C7  43.19,28.6 180 top
C8  32.29,11.34 0 top
C9  30.45,18.02 0 top
C10  18.23,27.19 180 top
C11  29.4,21.41 0 top
C12  30.34,9.62 0 top
C13  27.07,25.11 0 top
C14  20.31,23.13 90 top
C15  29.78,19.74 0 top
C16  17.39,28.98 90 top
C17  15.52,27.63 180 top
C18  18.36,23.72 0 top
C19  30.3,8.33 0 top
C20  17.57,13.49 270 top
C21  18.89,13.23 270 top
C22  32.71,19.08 0 top
C23  27.37,9.71 180 top
C24  26.14,10.46 270 top
C25  23.85,22.78 0 top
C27  33.55,10 0 top
C29  21.83,4.94 270 top
C30  32.83,5.07 270 top
C31  11.6,5.66 0 top
C32  40.67,9.17 180 top
C33  29.84,14.94 0 top
C34  40.13,5.98 0 top
C37  26.49,14.15 270 top
C38  19.79,14.05 180 top
C39  28.62,11.58 0 top
C42  27.07,27.42 0 top
C43  27.73,27.56 0 top
D2  11.85,9.32 0 top
D3  24.49,25.41 90 top
D4  8.9,7.9 90 top
D5  16.98,9.68 0 top
EPD_C1  12.1,21.03 180 top
EPD_C2  13.01,22.16 180 top
EPD_C5  11.99,17.76 180 top
EPD_C6  12.7,16.38 180 top
EPD_C7  12.83,15.28 180 top
EPD_C8  15.39,14.7 180 top
EPD_C9  14.34,13.6 180 top
EPD_C10  13.34,12.21 180 top
EPD_C11  13.07,10.91 180 top
EPD_C12  10.9,10.58 0 top
IC1  21.78,14.18 90 top
IC2  40.84,7.44 0 top
IC3  17.62,19 270 top
IC9  23.66,10.64 180 top
J1  8.98,17.46 270 top
J2  38.85,29.6 180 top
J4  24.1,33.67 180 top
L1  27.87,18.31 0 top
L2  22.52,25.03 270 top
L3  20.44,26.62 0 top
L5  6.41,31.16 0 top
L7  20.53,7.82 90 top
Q1  42.95,4.63 90 top
Q3  13.74,26.31 90 top
R1_EP_DR  11.96,24.54 0 top
R1_USB  27.05,26.7 270 top
R2  28.48,13.59 270 top
R2_EP_DR  13.37,26.31 270 top
R2_USB  20.22,27.55 0 top
R3  15.82,21.56 180 top
R4  21.6,11.89 90 top
R5  32.65,6.01 180 top
R7  21.82,5.57 90 top
R8  40.17,2.79 90 top
R9  22.65,13.01 0 top
R17  17.38,20.52 0 top
R18  29.07,12.93 270 top
R_PWR_EPD  44.88,4.87 180 top
R_TYPE_SEL  12.42,29.19 0 top
SJ1  10.93,32.22 0 top
SW_DN  23.05,3.12 180 top
SW_ENT  11.96,3.09 180 top
SW_UP  34,3.11 180 top
TP_3.3V  20.52,25.1 0 top
TP_3V3  43.13,30.48 0 top
TP_BAT_GND  43.21,25.97 0 top
TP_GND  17.36,32.85 0 top
TP_ON  43,7.17 0 top
TP_OP  42.58,10.04 0 top
TP_RESET  35.19,26.96 0 top
TP_SCL  17.81,11.2 0 top
TP_SDA  24.25,12.97 0 top
TP_SWDCLK  39.34,23.6 0 top
TP_SWDIO  26.9,16.88 0 top
TP_SWO  32.3,14.46 0 top
TP_VBAT  33,8.25 0 top
TP_VREG  25.66,8.31 0 top
U1  22.42,18.17 0 top
U3  36,9.51 0 top
X1  32.41,23.07 90 top
X2  14.37,19.24 270 top

### Tracks (layer width: path | path; a pad name or v marks a point on that pad's centre or on a via)
3V3/1.7D  (via drill 0.35)
  Top 0.3: v36.61,5.62 34.6,5.62 33.93,6.29 R5.2 32.53,6.17 32.39,6.17 32.05,5.82 23.41,5.82 23.16,5.57 R7.2 | R8.2 41.45,3.79 41.41,3.84 v41.41,3.72 | C34.2 40.35,5.98 40.35,6.38 40.84,6.86 IC2.C2 40.84,6.84 41.4,6.28
  Top 0.301: R_PWR_EPD.2 44.45,5.58 Q1.2 42.1,5.58 41.4,6.28 v41.37,6.31
  Route2 0.3: v41.41,3.72 41.09,4.04 41.09,6.03 v41.37,6.31
  Bottom 0.3: v36.61,5.62 38.26,5.62 39.78,4.1 41.03,4.1 v41.41,3.72
3V3/2.4A  (via drill 0.2, 0.3, 0.35)
  Top 0.3: C19.1 29.8,9.58 C12.1 29.84,9.77 31.44,11.37 31.76,11.37 | IC3.3 16.77,18.67 16.56,18.67 15.64,17.76 15.64,17.31 14.93,16.6 v14.03,16.6 | C7.1 43.69,29.92 TP_3V3.TP | v16.91,21.95 16.91,21.26 R17.1 17.58,20.79 18.4,19.97 IC3.10 18.3,19.84 18.3,20.06 18,20.36 v18,20.52 | C14.1 19.8,22.63 19.69,22.74 19.69,24.04 20.52,24.87 TP_3.3V.TP | v20.41,10.46 21.39,11.44 IC9.E3 IC9.E2 | v16.31,15.72 16.69,16.1 17.32,16.1 18.44,17.23 18.44,18.2 IC3.7 18.4,17.86 v17.95,17.42 | v25.17,20.8 24.67,21.31 U1.P$A22 24.67,21.47 25.16,21.97 v25.23,21.97 | 31.76,11.37 C8.1 | 31.76,11.37 31.78,11.37 C6.1 29.35,12.84 | v24.97,11.69 25.58,12.3 29.35,12.3 29.35,12.84 | 29.35,12.84 R18.1 | v18.79,21.68 18.79,21.45 19.17,21.07 | v19.26,15.72 19.29,15.75 19.29,16.31 U1.P$W1 | v17.8,15.14 18.4,15.74 18.61,15.74 19.17,16.3 U1.P$W1 | U1.P$W1 19.42,16.43 U1.P$Y2 | U1.P$AD23 v25.16,14.91 | 23.17,13.84 v23.2,13.84 23.2,14.3 22.67,14.83 U1.P$AD14 22.71,14.88 v22.75,14.88
  Top 0.301: TP_3V3.TP 40.05,30.48 J2.1 39.29,30.75 v39.29,34.03 | 29.33,14.93 C33.1 | C33.1 R18.1 | C33.1 25.19,14.94 U1.P$AD23
  Top 0.305: U1.P$B1 19.17,21.07 19.17,21.48 C14.1 21.78,22.63 21.93,22.78 C25.1 22.86,22.29 v22.86,22.08
  Route2 0.3: v16.91,21.95 16.91,22.07 18.4,22.07 v18.79,21.68 | v14.03,16.6 16.07,16.6 16.87,17.4 17.94,17.4 v17.95,17.42 | v25.16,14.91 24.09,13.84 v23.2,13.84
  Route2 0.301: v39.29,34.03 37.65,34.03 34.94,31.31 32.95,31.31 28.42,26.78 28.42,22.69 28.21,22.48 25.75,22.48 v25.23,21.97
  Route2 0.305: v22.86,22.08 22.86,21.32 23.29,20.88 25.1,20.88 v25.17,20.8
  Bottom 0.3: v24.97,11.69 24.43,11.15 23.93,11.15 23.7,11.38 | 23.7,11.38 23.1,10.77 23.1,10.63 22.14,9.68 21.19,9.68 v20.41,10.46 | v21.77,10.79 22.52,11.54 23.54,11.54 23.7,11.38 | v17.8,15.14 19.22,15.14 20.74,13.62 20.91,13.8 23.16,13.8 v23.2,13.84 | v16.31,15.72 v19.25,15.72 v19.26,15.72 | v18,20.52 17.31,21.21 16.43,21.21 16.34,21.12 16.34,17.61 16.53,17.42 v17.95,17.42
DN  (via drill 0.2, 0.35)
  Top 0.152: D3.1 23.16,24.55 23.16,25.8 22.28,26.68 v21.69,26.68 | J4.A7 23.85,29.03 | 23.85,29.03 23.85,29.55 24.25,29.95 24.47,29.95 24.85,29.56 J4.B7 | v23.78,28.06 23.78,28.97 23.85,29.03
  Bottom 0.152: v23.78,28.06 22.87,27.15 22.08,27.15 21.69,26.77 v21.69,26.68
DP  (via drill 0.2, 0.35)
  Top 0.152: D3.3 25.73,24.45 25.73,25.72 v26.23,26.22 | v22.25,27.91 22.51,28.17 23.09,28.17 23.35,28.43 J4.B6 | v24.48,27.86 24.35,27.99 J4.A6
  Route2 0.152: v22.25,27.91 23.15,27.91 23.51,27.55 24.16,27.55 v24.48,27.86
  Bottom 0.152: v26.23,26.22 26.23,26.69 25.06,27.86 v24.48,27.86
EPD_3V3  (via drill 0.2, 0.3, 0.35)
  Top 0.152: 10.58,16.28 10.65,16.35 10.94,16.35 11.49,16.9 EPD_C5.2 11.49,18.89 C1-EP-DR.1
  Top 0.3: 10.58,16.28 J1.15 J1.16 10.63,15.82 v11.4,15.82 | Q1.3 41.2,5.29 38.51,5.29 v36.48,7.32 | 11.46,29.93 v11.47,29.93 9.94,29.93 L5.2 | v11.48,19.9 11.48,19.1 C1-EP-DR.1
  Route2 0.3: v36.48,7.32 18.36,7.32 11.4,14.28 v11.4,15.82 | v11.47,29.93 11.47,19.91 v11.48,19.9
GDR  (via drill 0.2)
  Top 0.152: v12.51,24.72 13.06,25.27 Q3.1 R2_EP_DR.2 13.11,26.3 | J1.2 v10.52,22.71
  Bottom 0.152: v12.51,24.72 10.52,22.73 v10.52,22.71
GND  (via drill 0.2, 0.3, 0.35)
  Top 0.152: 8.12,24 J1.MP1 | TP_GND.TP 18.18,33.67 J4.SH2 | TP_BAT_GND.TP 43.21,25.52 42.69,26.04 C7.2 | IC2.B3 42.74,8.84 43.08,8.84 43.79,9.55 43.79,9.56 43.93,9.7 43.79,9.84 43.79,10.54 43.08,11.25 42.08,11.25 41.38,10.54 41.38,9.69 C32.1 | SW_UP.1 34.9,4.58 34.9,4.86 34.7,5.07 C30.1 | U3.6 36.25,9.26 U3.9 | v12.64,5.96 11.62,5.96 C31.1 9.12,5.94 D4.1 | J1.MP2 10.07,10.92 EPD_C12.1 | U1.P$B7 20.92,20.28 U1.P$75 | C29.1 22.3,5.14 23.63,5.14 | 23.63,5.14 23.8,5.14 v23.8,5.3 | 26.15,10.97 C24.1 | R2_USB.2 19.99,27.49 19.96,27.49 19.69,27.76 19.69,27.95 20.56,28.83 21.02,28.83 J4.A12_B1 20.36,28.95 J4.SH4 19.2,29.52 18.88,29.21 18.88,28.97 v18.43,28.52 18.35,28.52 C16.2 | J4.SH3 27.88,29.52 J4.A1_B12 28.21,28.04 28.21,27.72 27.99,27.5 27.96,27.5 C43.2 27.2,27.28 C42.2 27.33,26.88 R1_USB.1 | C13.2 27.7,24.98 C2.2 | C1.2 31.14,23.04 X1.4 31.83,21.31 v32.31,20.83 | C11.2 30.92,20.39 30.92,19.1 30.95,19.12 | 30.95,19.12 C9.2 | C22.2 32.42,19.88 31.71,19.88 30.95,19.12 | IC9.C3 IC9.C2 IC9.C1 IC9.B1 24.54,10.24 v24.92,9.85 | X1.2 33.76,24.57 v34.25,24.57 | C38.1 19.79,13.63 C21.2 18.63,12.99 C20.2 16.71,13.86 16.25,13.86 15.89,14.22 EPD_C8.1 | EPD_C2.1 13.51,24.04 14,24.54 14.73,24.54 14.74,24.55 | R2_EP_DR.1 13.68,26.34 14.17,26.34 14.52,25.99 14.73,25.99 14.74,25.98 | EPD_C2.1 13.51,21.94 EPD_C1.1 12.6,19 C1-EP-DR.2 12.59,17.86 EPD_C5.1 | IC2.B1 39.91,7.44 v39.71,7.64 | C15.2 29.73,19.18 26.23,19.18 25.91,19.51 25.66,19.51 25.49,19.68 U1.P$F23 24.52,19.68 U1.P$78 24.39,20.14 24.39,22.74 C25.2 24.49,22.92 D3.2 | 30.8,9.58 C12.2 31.08,9.62 | C27.1 33.57,10.26 | 14.74,24.55 14.85,24.66 14.85,25.87 14.74,25.98
  Top 0.152: 14.74,24.55 14.74,23.39 EPD_C2.1 | 14.74,25.98 14.74,26.97 14.51,27.2 14.51,28.06 14.63,28.18 15.4,28.18 15.95,27.63 C17.1 17.29,27.63 C10.2 | C14.2 20.83,23.63 v21.11,23.35 | 23.63,5.14 23.78,4.99 23.83,4.99 24.35,4.48 24.35,4.19 SW_DN.1 | v16.8,24.18 17.4,24.18 C18.1 17.5,23.72 C5.1 16.45,22.47 R3.2 | C34.1 39.12,6.8 v39.07,6.8 | v18.29,16.24 18.29,16.61 18.78,17.1 18.78,18.48 18.52,18.75 IC3.8 | J2.5 36.87,29.84 v33.84,29.84 | v14.37,4.86 13.57,4.06 SW_ENT.1 | C33.2 31.19,15.79 C3.2 | U1.P$81 U1.P$74 22.42,16.98 | R9.1 22.71,13.34 22.71,14.29 22.61,14.38 IC1.D2 22.37,14.37 v22.29,14.37 | 21.82,16.41 U1.P$88 21.82,16.32 v20.93,15.43
  Top 0.3: EPD_C7.1 13.33,16.25 EPD_C6.1 12.78,16.8 12.78,16.84 12.49,17.14 EPD_C5.1 | J2.5 J2.3
  Route2 0.152: v39.71,7.64 39.21,8.14 38.93,8.14 38.93,8.93 40.11,10.11 40.86,10.11 41.02,10.26 41.02,10.93 41.67,11.59 43.25,11.59 44.35,10.49 44.35,9.27 43.51,8.42 42.77,8.42 41.77,7.43 41.39,7.43 | v18.43,28.52 18.43,27.92 17.81,27.3 | 20.95,20.89 20.95,23.19 v21.11,23.35 | 20.25,23.42 18.09,25.58 18.09,25.67 17.75,26.01 17.27,26.01 16.93,25.67 16.93,24.31 v16.8,24.18 | v22.29,14.37 22.26,14.4 22.26,15.01 21.74,15.53 21.02,15.53 v20.93,15.43
  Bottom 0.152: v39.07,6.8 39.07,7 v39.71,7.64 | v18.29,16.24 19.21,16.24 19.51,16.54 19.8,16.54 19.96,16.38 U1.P$87 | v33.84,29.84 32.8,29.84 32.8,26.03 v34.25,24.57 34.25,22.21 32.87,20.83 v32.31,20.83 | v23.8,5.3 23.8,8.73 v24.92,9.85 | v12.64,5.96 13.27,5.96 v14.37,4.86
  pour Top: 7.68,9.83 7.66,9.81 7.64,9.8 0.94,9.8 0.94,3.92 4.23,0.64 42.8,0.64 46.06,3.89 46.06,15.1 45.88,15.28 37.56,15.28 37.53,15.29 37.44,15.39 37.43,15.42 37.43,18.6 37.44,18.63 37.46,18.65 37.49,18.66 37.52,18.66 37.55,18.65 37.61,18.59 45.05,18.59 45.53,19.07 45.53,30.95 41.48,35.01 41.45,34.97 41.42,34.96 3.15,34.96 2.96,34.77 2.95,34.77 0.64,32.45 0.64,25.23 0.97,24.9 6.66,24.9 6.69,24.89 7.68,23.89 7.7,23.86 7.7,9.86
  pour Route2: 0.63,9.6 0.64,9.57 0.64,4.01 3.96,0.69 43.28,0.69 46.33,3.74 46.33,14.7 36.48,14.7 36.45,14.71 36.43,14.73 36.42,14.76 36.42,14.79 36.43,14.82 36.59,14.99 36.59,19.13 36.61,19.16 36.63,19.18 36.66,19.19 46.68,19.19 46.68,31.39 42.66,35.41 4.29,35.41 4.29,35.41 4.28,35.41 4.27,35.41 4.26,35.42 4.25,35.42 3.97,35.42 0.47,31.92 0.47,25.43 0.78,25.12 6.95,25.12 6.98,25.11 7.8,24.29 7.81,24.26 7.81,10.25 7.8,10.22 7.42,9.84 7.4,9.83 0.4,9.83
  pour Route15: 8.08,10.01 7.69,9.62 7.66,9.61 0.66,9.61 0.66,4.62 4.42,0.86 43.05,0.86 46.51,4.31 46.51,14.83 36.5,14.83 36.47,14.84 36.26,15.05 36.25,15.08 36.25,18.73 36.26,18.76 36.41,18.91 36.43,18.92 46.63,18.92 46.63,30.54 41.88,35.29 3.87,35.29 0.6,32.02 0.6,25.23 0.85,25.48 0.87,25.49 6.8,25.49 6.83,25.48 8.08,24.23 8.09,24.2 8.09,10.04
IMU_INT1  (via drill 0.15, 0.35)
  Top 0.152: IC3.5 17.22,18.07 17.22,17.66 15.22,15.65 v14.17,15.65 | 19.24,17.85 U1.P$N1 19.27,17.82 19.69,17.82 19.73,17.78 v19.77,17.78
  Bottom 0.152: v14.17,15.65 14.58,15.65 15.95,17.02 18.24,17.02 19.1,17.89 19.66,17.89 v19.77,17.78
IMU_INT2  (via drill 0.2, 0.3)
  Top 0.152: v19.1,16.89 19.1,17.11 U1.P$P2 | v17.06,16.61 17.06,17.07 17.87,17.88 IC3.6
  Bottom 0.152: v17.06,16.61 17.18,16.74 18.67,16.74 18.82,16.89 v19.1,16.89
LX1
  Top 0.152: IC9.B2 IC9.B3 23.16,10.24 22.44,9.51 22.44,8.77 21.71,8.05 21.53,8.05 20.28,6.8 | 20.28,6.8 | 20.28,6.8 L7.1
LX2
  Top 0.152: IC9.D2 IC9.D3 23.06,11.04 22.16,10.14 22.16,9.11 21.9,8.85 L7.2
N$1
  Top 0.152: IC3.1 15.82,20.77 R3.1
N$2
  Top 0.152: C5.2 18.41,21.71 18.41,21.18 U1.P$C1
N$3  (via drill 0.2, 0.35)
  Top 0.152: L2.2 22.52,24.1 v21.69,24.1 | v19.91,21.38 U1.P$B3
  Bottom 0.152: v21.69,24.1 21.69,22.59 20.35,21.25 20.05,21.25 v19.91,21.38
N$5
  Top 0.152: R4.2 21.96,11.8 23.81,11.8 24.06,11.54 IC9.D1
N$6  (via drill 0.3, 0.35)
  Top 0.152: C16.1 18.69,27.19 C10.1 19.37,27.19 L3.1 19.57,26.26 19.45,26.26 18.63,25.43 v17.51,25.43 | v20.38,21.92 20.38,20.96 U1.P$B5 20.42,21.13 21.35,22.06 v21.97,22.06 | C15.1 27.32,19.74 v27.11,19.95 27.09,19.93 U1.P$E24
  Route2 0.152: v17.51,25.43 20.38,22.56 v20.38,21.92
  Bottom 0.152: v27.11,19.95 25.81,21.24 22.54,21.24 21.97,21.81 v21.97,22.06
N$7
  Top 0.152: R9.2 22.59,12.8 22.4,12.8 21.98,13.22 22.38,13.63 IC1.D1
N$8  (via drill 0.3)
  Top 0.152: R2.2 v27.64,13.59 v27.64,13.6 | IC9.E1 24.24,11.44 v24.99,10.69
  Bottom 0.152: v27.64,13.6 24.99,10.95 v24.99,10.69
N$9  (via drill 0.3, 0.35)
  Top 0.152: C13.1 26.01,24.54 26.01,23.37 v25.78,23.15 | v23.73,21.93 23.67,21.88 U1.P$A18
  Bottom 0.152: v25.78,23.15 24.57,21.93 v23.73,21.93
N$10
  Top 0.152: L2.1 21.83,26.22 21.5,26.22 21.1,26.62 L3.2
N$11  (via drill 0.3, 0.35)
  Top 0.152: Q3.3 13.74,27.73 v13.08,28.4 | C2-EP-DR.2 13.1,8.72 18.16,8.72 v18.77,8.1 | v4.28,27.29 4.28,31.01 L5.1
  Top 0.301: v18.77,8.1 18.73,8.15 D5.2 18.51,9.46 v17.48,9.46
  Bottom 0.152: v17.48,9.46 13.08,13.86 v13.08,28.4 5.38,28.4 v4.28,27.29
N$12  (via drill 0.2, 0.35)
  Top 0.152: C17.2 15.02,26.1 15.13,25.99 15.13,23.2 14.37,22.44 14.37,21.66 | v19.58,20.63 19.67,20.55 U1.P$D2 | X2.1 14.37,21.66 | v15.57,26.64 15.57,22.86 14.37,21.66
  Bottom 0.152: v15.57,26.64 15.57,26.44 19.5,22.51 19.5,20.71 v19.58,20.63
N$13  (via drill 0.2, 0.3, 0.35)
  Top 0.152: v18.4,22.73 18.86,23.19 C18.2 | v19.3,19.94 19.41,19.94 U1.P$F2 | X2.2 v14.4,17.95
  Route2 0.152: v19.3,19.94 19.3,19.86 17.17,19.86 15.27,17.95 v14.4,17.95
  Bottom 0.152: v18.4,22.73 18.4,20.84 v19.3,19.94
N$14
  Top 0.152: C20.1 17.68,13.99 18.94,15.25 20.25,15.25 U1.P$AC5
N$15
  Top 0.152: C11.1 28.07,20.57 25.57,20.57 U1.P$D23
N$16
  Top 0.152: X1.3 28.7,23.8 28.07,23.17 26.87,23.17 26.7,23.33 C2.1 26.7,21.91 26.22,21.43 U1.P$A23
N$17
  Top 0.152: X1.1 33.29,22.05 33.29,20.38 32.1,20.38 29.46,23.01 C1.1 27.35,20.93 U1.P$B24
N$18
  Top 0.152: U1.P$H23 25.49,19.18 25.56,19.24 25.78,19.24 26.29,18.73 26.72,18.31 L1.1 28.49,17.19 29.77,17.19 C3.1
N$19
  Top 0.152: 34.62,18.44 36.03,17.03 38.64,17.03 ANT1.1 | 34.62,18.44 C4.1 | L1.2 29.21,17.47 31.49,17.47 31.64,17.62 31.64,18.64 32.08,19.09 C22.1 32.86,18.44 34.62,18.44
N$21
  Top 0.152: SJ1.2 11.96,31.96 R1_EP_DR.1 12.23,25.08 12.23,28.72 R_TYPE_SEL.2
N$22  (via drill 0.3, 0.35)
  Top 0.152: C9.1 29.37,18.6 v29.27,18.6 | U1.P$N24 25.96,18.22 v26.15,18.22
  Bottom 0.152: v29.27,18.6 28.96,18.91 26.84,18.91 v26.15,18.22
N$23
  Top 0.152: C2-EP-DR.1 10.1,7.49 D2.1 9.23,9.32 D4.2
N$24
  Top 0.152: EPD_C2.2 12.07,21.72 10.52,21.72 J1.4
N$25
  Top 0.152: IC2.A2 40.87,7.94 40.87,8.4 40.54,8.73 40.54,9.11 C32.2
N$26
  Top 0.152: EPD_C1.2 11.42,21.21 J1.5
N$27  (via drill 0.2, 0.35)
  Top 0.152: R1_USB.2 26.39,27.09 v26.39,27.29 | J4.A5 v25.34,28.95
  Bottom 0.152: v26.39,27.29 25.63,28.04 25.63,28.66 v25.34,28.95
N$29
  Top 0.152: J1.18 10.65,14.85 10.94,14.85 12.2,16.11 12.2,16.15 EPD_C6.2
N$30
  Top 0.152: J1.19 10.65,14.35 10.94,14.35 11.87,15.28 EPD_C7.2
N$31
  Top 0.152: J1.20 10.65,13.85 10.94,13.85 11.02,13.93 12.61,13.93 13.38,14.7 EPD_C8.2
N$32  (via drill 0.2, 0.35)
  Top 0.152: R2_USB.1 20.79,27.82 v21.07,27.54 | J4.B5 v22.36,28.89
  Bottom 0.152: v21.07,27.54 22.36,28.83 v22.36,28.89
N$33
  Top 0.152: J1.22 10.63,12.58 12.46,12.58 EPD_C10.2
N$35
  Top 0.152: J1.24 11.4,10.81 EPD_C12.2
OUT+
  Top 0.152: IC2.A3 41.34,8.8 TP_OP.TP
OUT-
  Top 0.152: IC2.C3 41.57,7.17 TP_ON.TP
P0.13/1.5D
  Top 0.152: SW_UP.2 32.6,5.02 C30.2
  Top 0.3: R5.1 32.66,5.17 C30.2
P0.14/1.5D  (via drill 0.3, 0.35)
  Top 0.152: v34.78,6.48 34.24,6.48 34.07,6.65 32.26,6.65 31.79,6.18 21.9,6.18 21.71,5.99 21.38,5.99 20.78,5.39 C31.2 11.06,4.85 11.06,4.56 SW_ENT.2 | R8.1 39.87,2.81 v38.89,2.81
  Bottom 0.152: v34.78,6.48 38.45,2.81 v38.89,2.81
P1.01/1.6C
  Top 0.152: R_PWR_EPD.1 Q1.1
P1.02/1.6C
  Top 0.152: R7.1 C29.2 21.55,4.19 SW_DN.2
PMIC_INT  (via drill 0.15, 0.35)
  Top 0.152: IC1.A1 21.08,13.98 v19.94,12.84
  Route2 0.152: v19.94,12.84 19.9,12.88 19.9,16.98 19.7,17.18 U1.P$T2
  other vias: 19.67,17.17
PREVGH
  Top 0.152: J1.21 10.65,13.35 10.94,13.35 11.19,13.6 EPD_C9.2 15.23,12.21 D5.1
PREVGL
  Top 0.152: D2.2 13.6,9.88 EPD_C11.2 11.28,12.21 J1.23
RESE
  Top 0.152: Q3.2 14.16,25.27 13.15,24.26 R1_EP_DR.2 12.33,23.89 12.33,23.55 10.98,22.21 J1.3
RESET  (via drill 0.2, 0.35)
  Top 0.152: TP_RESET.TP 35.26,26.96 J2.6 37.26,28.27 36.6,27.6 36.6,18.05 v36.46,17.91 | v22.48,15.48 v22.47,15.48 U1.P$AC13
  Bottom 0.152: v36.46,17.91 33.93,15.38 22.53,15.38 22.48,15.44 v22.48,15.48
SCL/1.4C
  Top 0.152: U3.7 37.15,9.6 37.43,9.6 37.83,9.2 37.83,7.96 38.12,7.67 38.96,7.67 39.69,6.94 IC2.C1
SCL/2.4C  (via drill 0.2, 0.3)
  Top 0.152: R4.1 | R17.2 IC3.12 17.37,19.83 16.84,20.36 v16.84,20.65 | v16.25,12.28 17.32,11.2 TP_SCL.TP 20.64,11.2 R4.1 | R4.1 21.23,11.98 21.23,13.6 21.58,13.95 IC1.B1 | U1.P$M2 19.67,18.37 v19.63,18.41
  Route2 0.152: v16.25,12.28 16.94,12.96 16.94,15.68 18.61,17.36 18.61,18.31 19.04,18.73 19.19,18.73 19.51,18.41 v19.63,18.41
  Bottom 0.152: v16.84,20.65 16.71,20.51 16.71,17.82 18.57,17.82 18.97,18.21 19.44,18.21 v19.63,18.41
SDA/1.4C  (via drill 0.2, 0.35)
  Top 0.152: U3.8 37.15,10.1 37.43,10.1 38.96,8.57 v39.7,8.57
  Bottom 0.152: v39.7,8.57 40.83,7.44 IC2.B2
  other vias: 40.84,7.44
SDA/2.4C  (via drill 0.15, 0.3, 0.35)
  Top 0.152: v17.86,21.41 17.86,21.33 18.55,20.64 18.55,20.32 18.86,20.01 18.86,18.81 19.17,18.5 U1.P$L1 19.2,18.39 19.2,17.92 v19.14,17.86 19.22,17.93 | TP_SDA.TP 28.75,12.97 R18.2 28.8,13.55 R2.1 | TP_SDA.TP 23.51,12.23 v22.39,12.23 | v21.69,12.74 21.69,13.65 21.98,13.95 IC1.C1 | TP_SDA.TP 24.25,13.65 | v15.76,19.8 16.11,19.8 16.67,19.25 IC3.2
  Route2 0.152: v17.86,21.41 17.8,21.35 16.62,21.35 16.1,20.83 16.1,20.14 v15.76,19.8 | v19.14,17.86 19.14,17.77 19.34,17.58 19.34,15.74 18.12,14.52 18.12,12.33 18.54,11.91 20.83,11.91 21.15,12.23 v22.38,12.23 v22.39,12.23
  Bottom 0.152: v22.39,12.23 21.88,12.74 v21.69,12.74
SWDCLK  (via drill 0.2, 0.35)
  Top 0.152: J2.4 39.34,28.16 TP_SWDCLK.TP 39.3,23.64 v37.24,23.64 | v25.23,15.77 25.39,15.93 U1.P$AA24
  Bottom 0.152: v37.24,23.64 32.92,19.33 32.92,17.32 32.82,17.22 28.3,17.22 27.99,16.92 27.99,16.23 27.54,15.77 v25.23,15.77
SWDIO  (via drill 0.3, 0.35)
  Top 0.152: U1.P$AC24 26.77,16.53 26.77,16.76 TP_SWDIO.TP 27.69,16.88 v28.65,15.92 | v41.92,21.82 40.72,23.01 40.72,25.03 39.7,26.06 39.7,28.86 J2.2
  Bottom 0.152: v28.65,15.92 33.38,15.92 39.27,21.82 v41.92,21.82
SWO  (via drill 0.3)
  Top 0.152: v28.29,14.15 28.2,14.06 27.48,14.06 27.02,14.53 24.8,14.53 24.67,14.66 U1.P$AD22 | TP_SWO.TP 31.9,14.06 v30.12,14.06
  Bottom 0.152: v28.29,14.15 28.38,14.06 v30.12,14.06
VBAT/1.2A
  Top 0.301: U3.2 33.57,9.76 C27.2 33,9.18 TP_VBAT.TP
  Top 0.305: U3.2 U3.3
VBAT/2.5C  (via drill 0.15, 0.35)
  Top 0.3: v26.24,13.46 26.22,13.48 C37.2 | v21.53,15.04 21.98,14.59 IC1.C2
  Bottom 0.3: v26.24,13.46 26.18,13.41 25.36,13.41 24.34,14.42 22.15,14.42 v21.53,15.04
VBUS/1.5D
  Top 0.3: C43.1 27.6,27.69 C42.1 26.5,28.26 | 26.5,28.26 26.5,28.52 | 26.5,28.26 26.5,28.21 26.02,27.73 25.02,27.73 24.49,27.19 D3.5
  Top 0.305: J4.A4_B9 26.5,28.52 | J4.A9_B4 21.7,27.59 22.08,27.22 22.61,27.22 22.96,27.57 24.1,27.57 24.49,27.18 D3.5
VBUS/2.6D
  Top 0.3: C38.2 19.79,14.77 19.79,14.8 U1.P$AD2 18.89,14.15 C21.1 | C38.2 19.82,14.36 | C38.2 19.84,14.38 IC1.A2
VREG  (via drill 0.15, 0.35)
  Top 0.152: TP_VREG.TP 25.66,8.59
  Top 0.3: v23.2,8.92 23.26,8.98 IC9.A3 IC9.A2 IC9.A1 25.31,8.59 25.66,8.59 | TP_VREG.TP 26.14,8.79 C24.2 26.17,9.99 C23.2 28.12,10.74 28.12,11.38 | IC1.B2 v21.57,14.38 | v21.57,14.38
  Top 0.301: 28.12,11.38 C39.1
  Route2 0.3: v23.2,8.92 23.2,12.62 21.57,14.25 v21.57,14.38